# Altium schematic sheet Sheet1.SchDoc
size A0; SheetNumber: 1; SheetTotal: 1
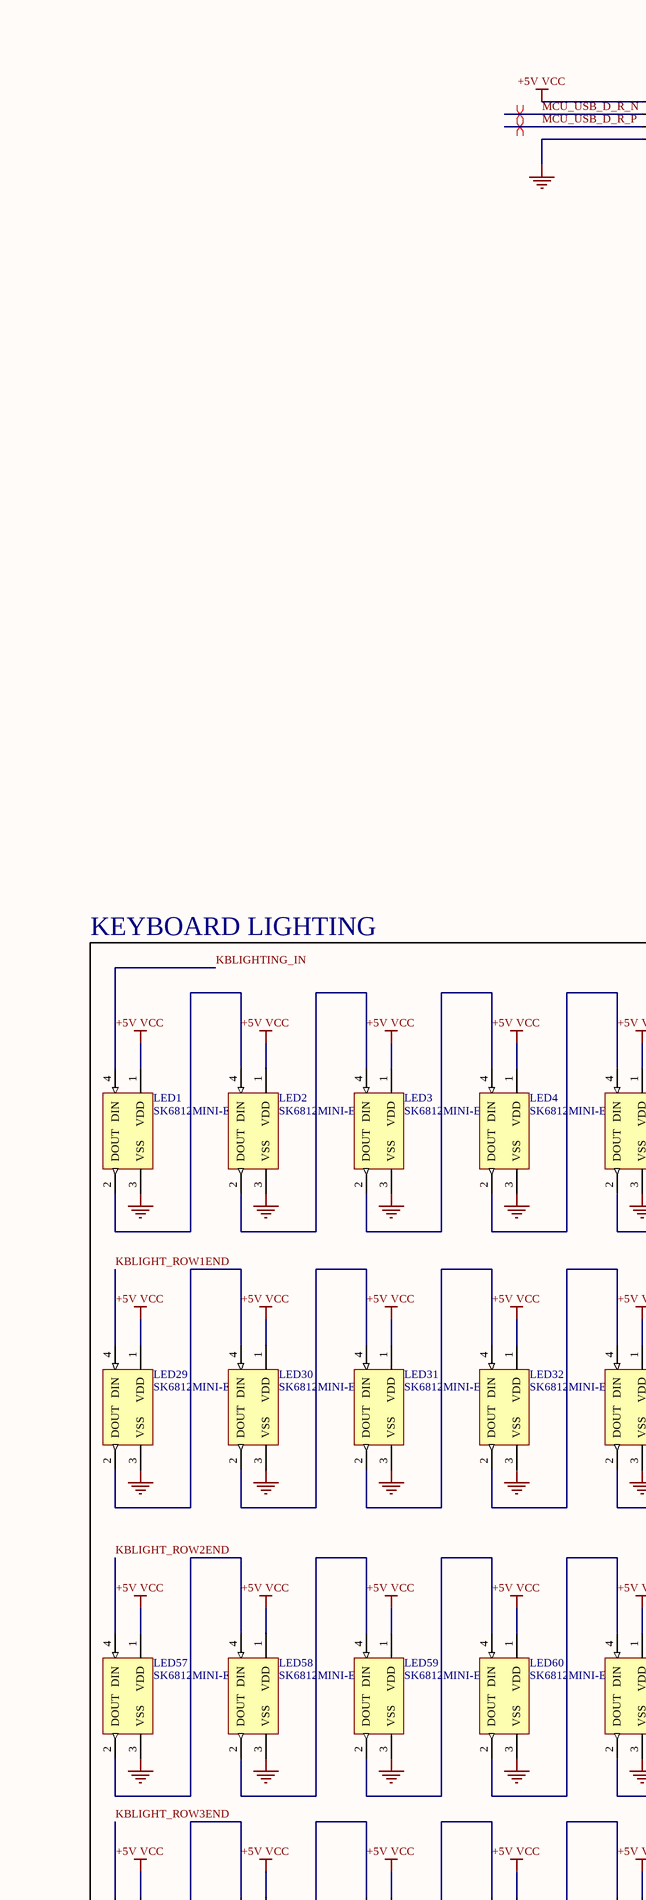
[diagram p0: Sheet1.SchDoc, top left]
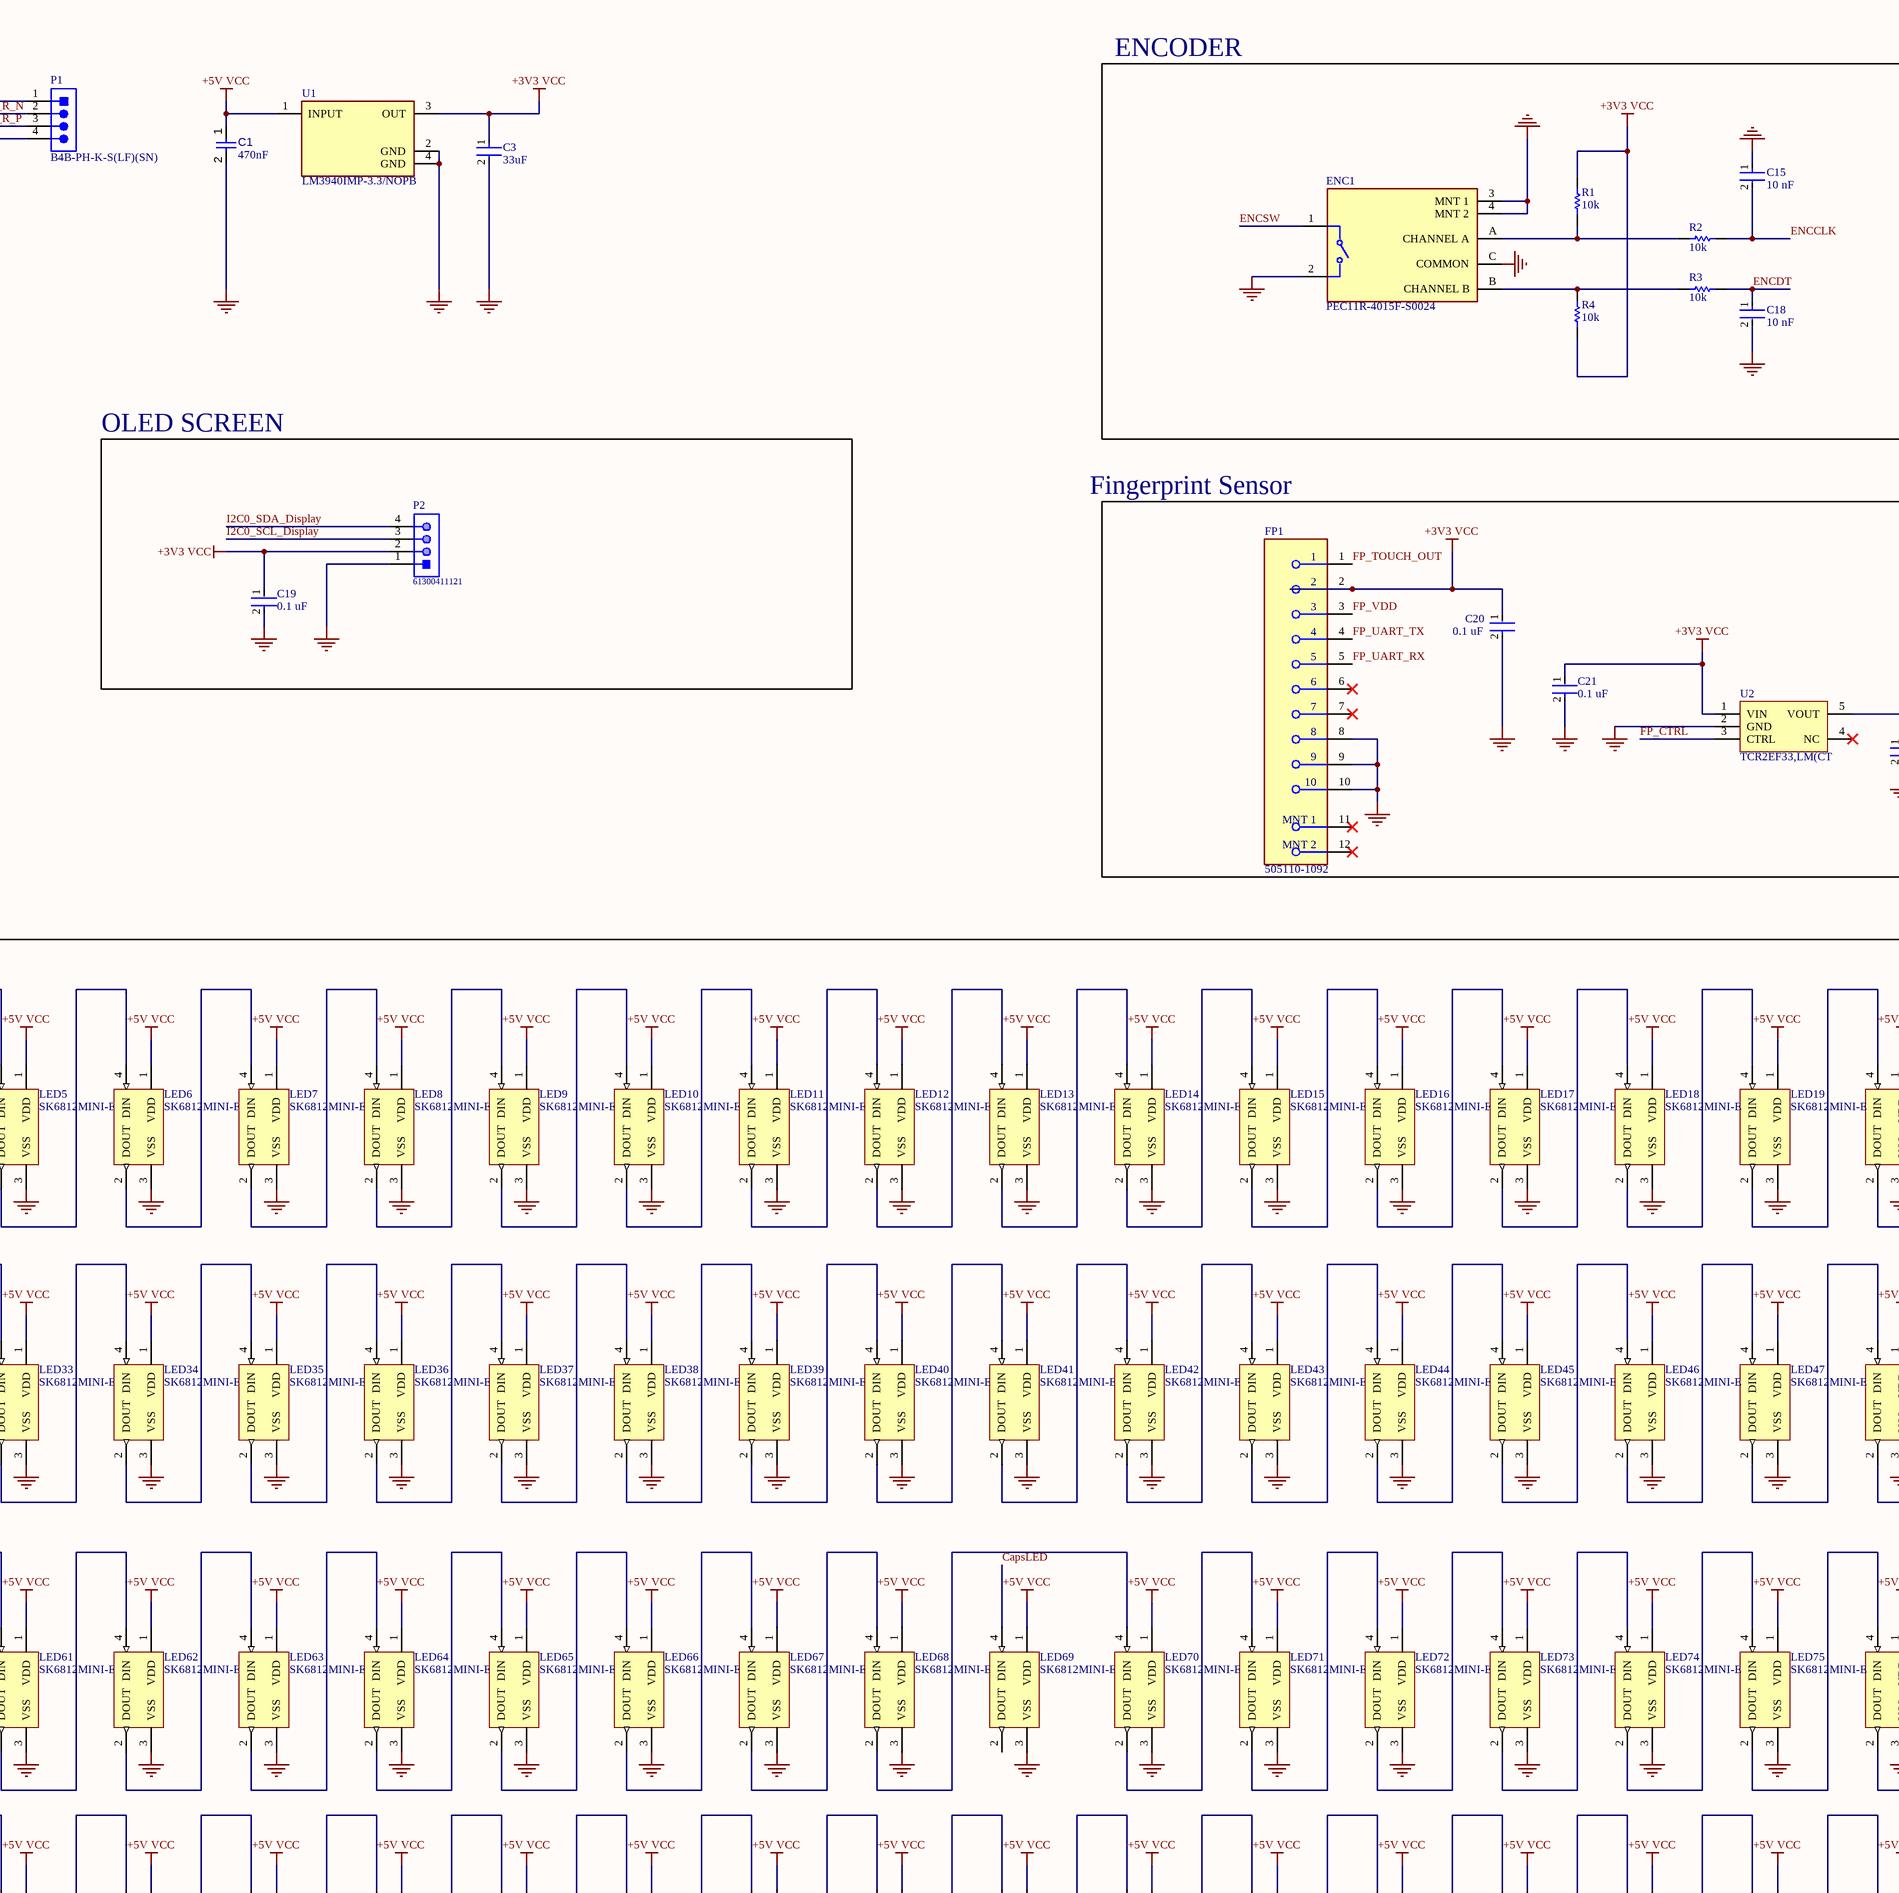
[diagram p1: Sheet1.SchDoc, top middle]
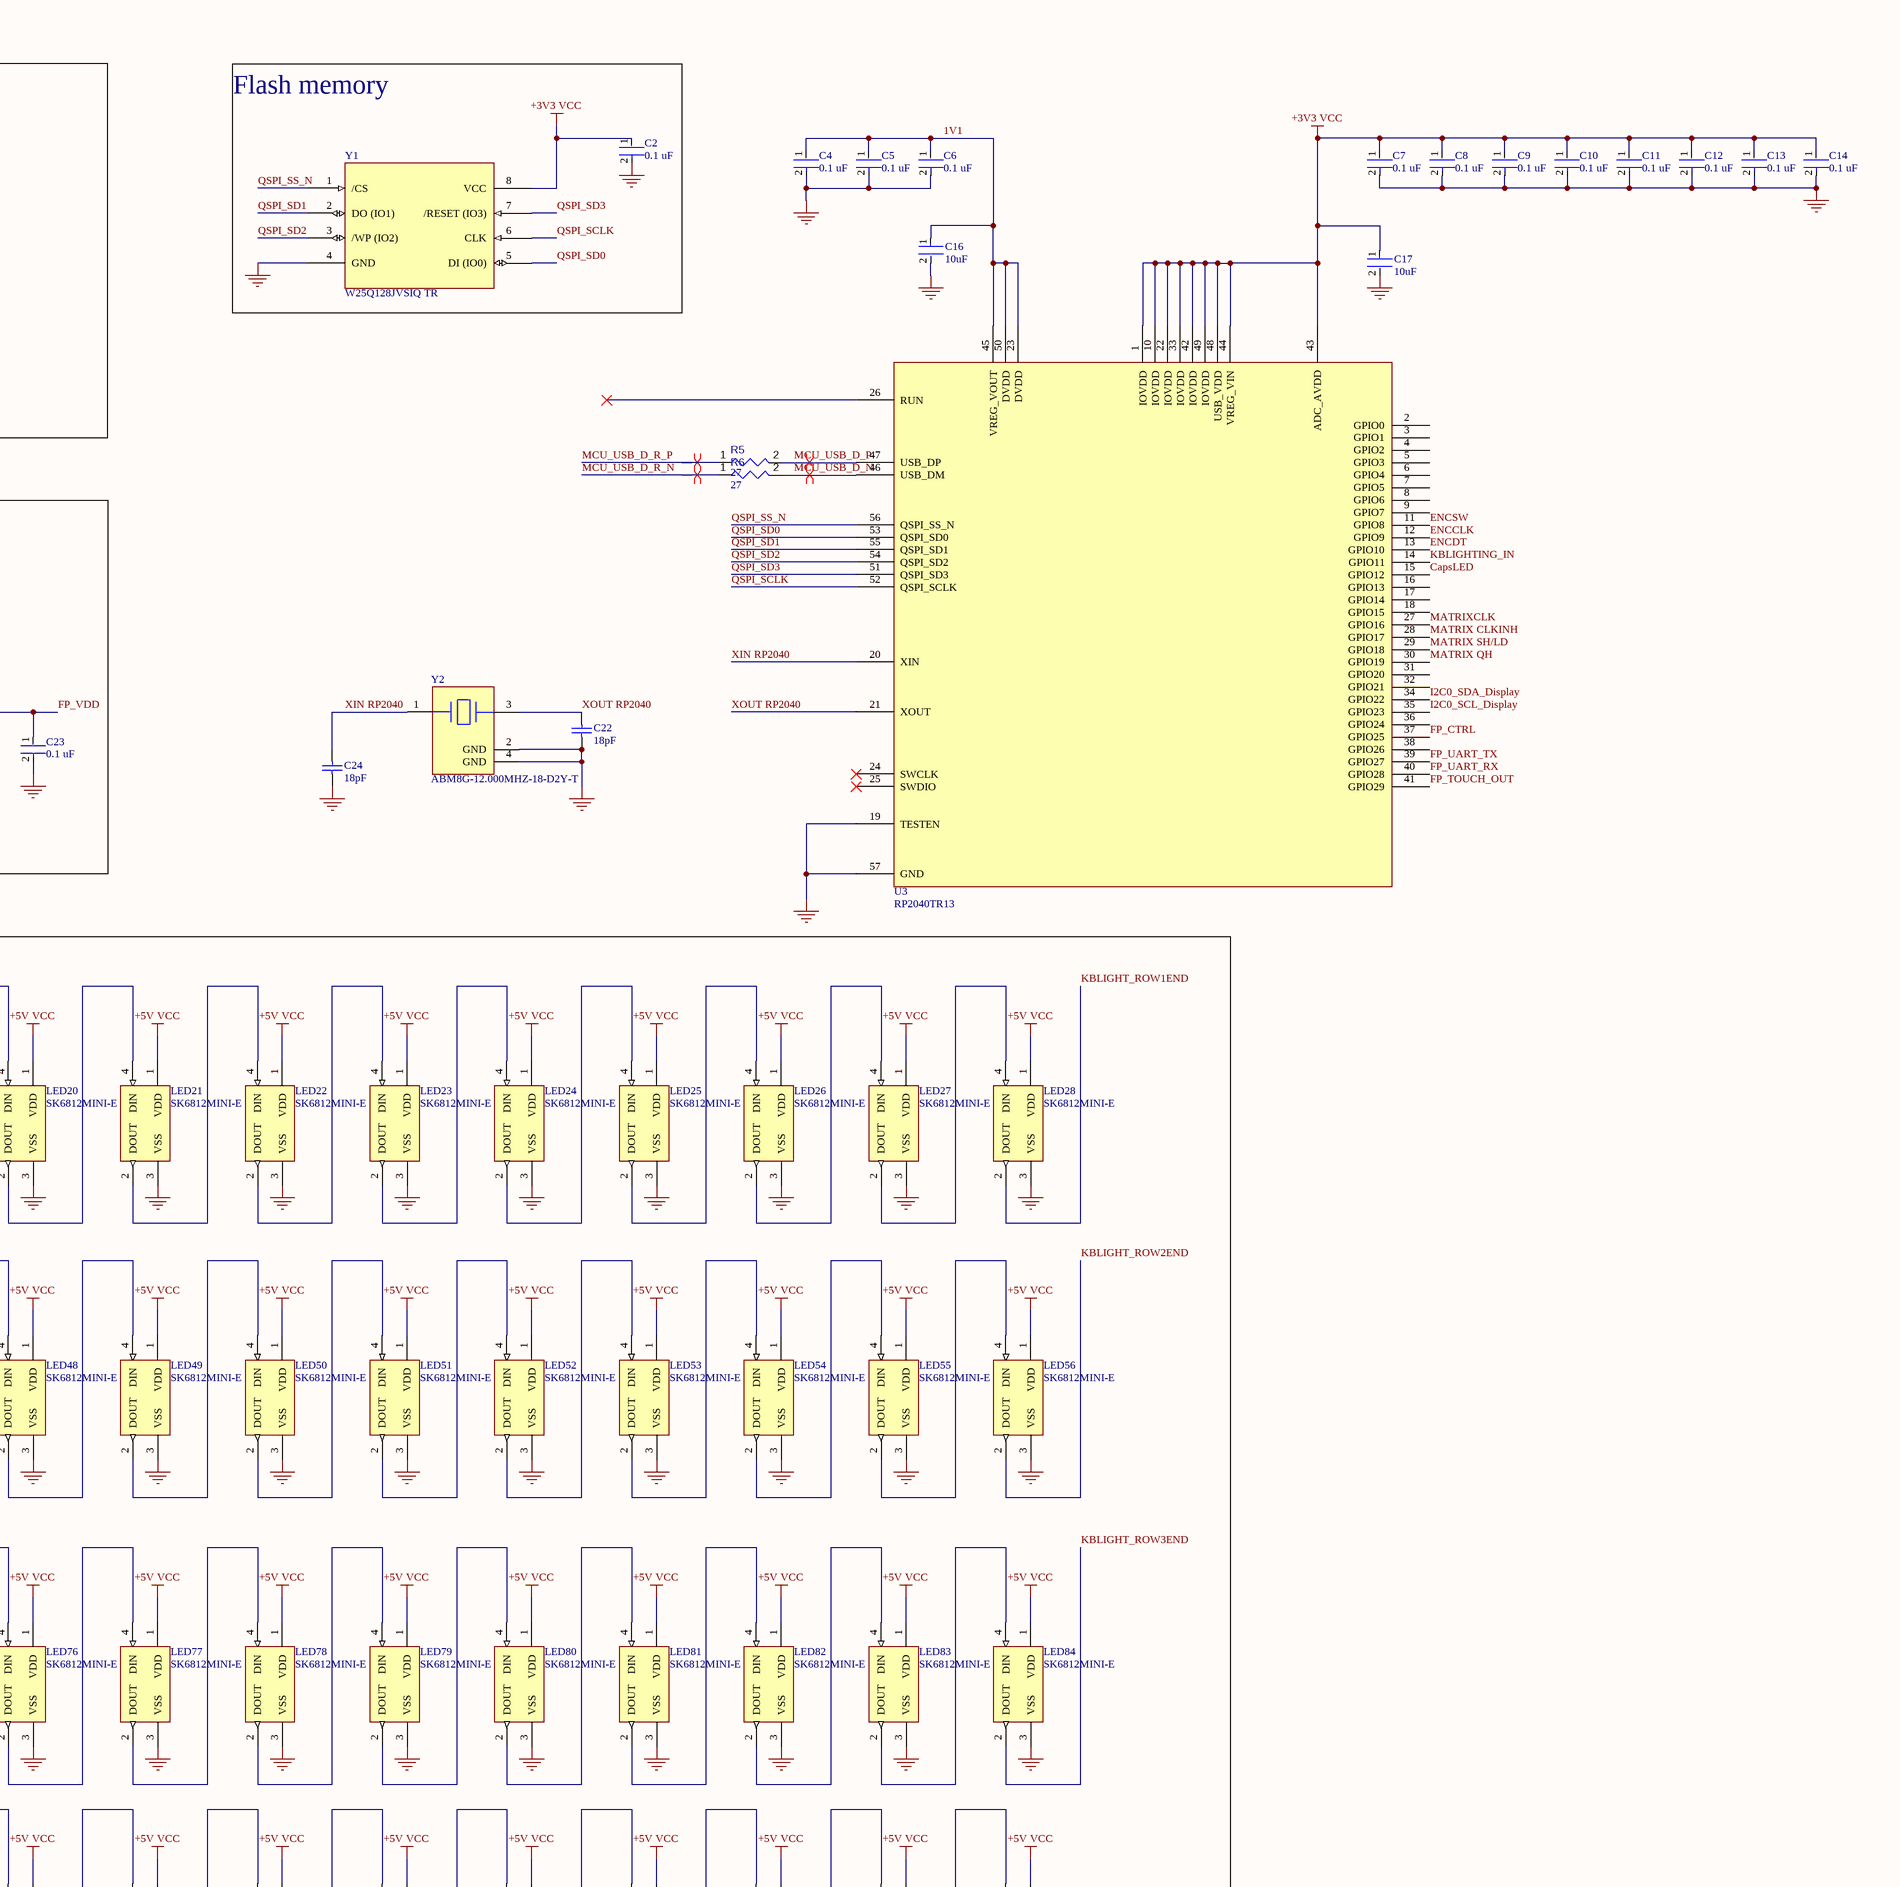
[diagram p2: Sheet1.SchDoc, top right]
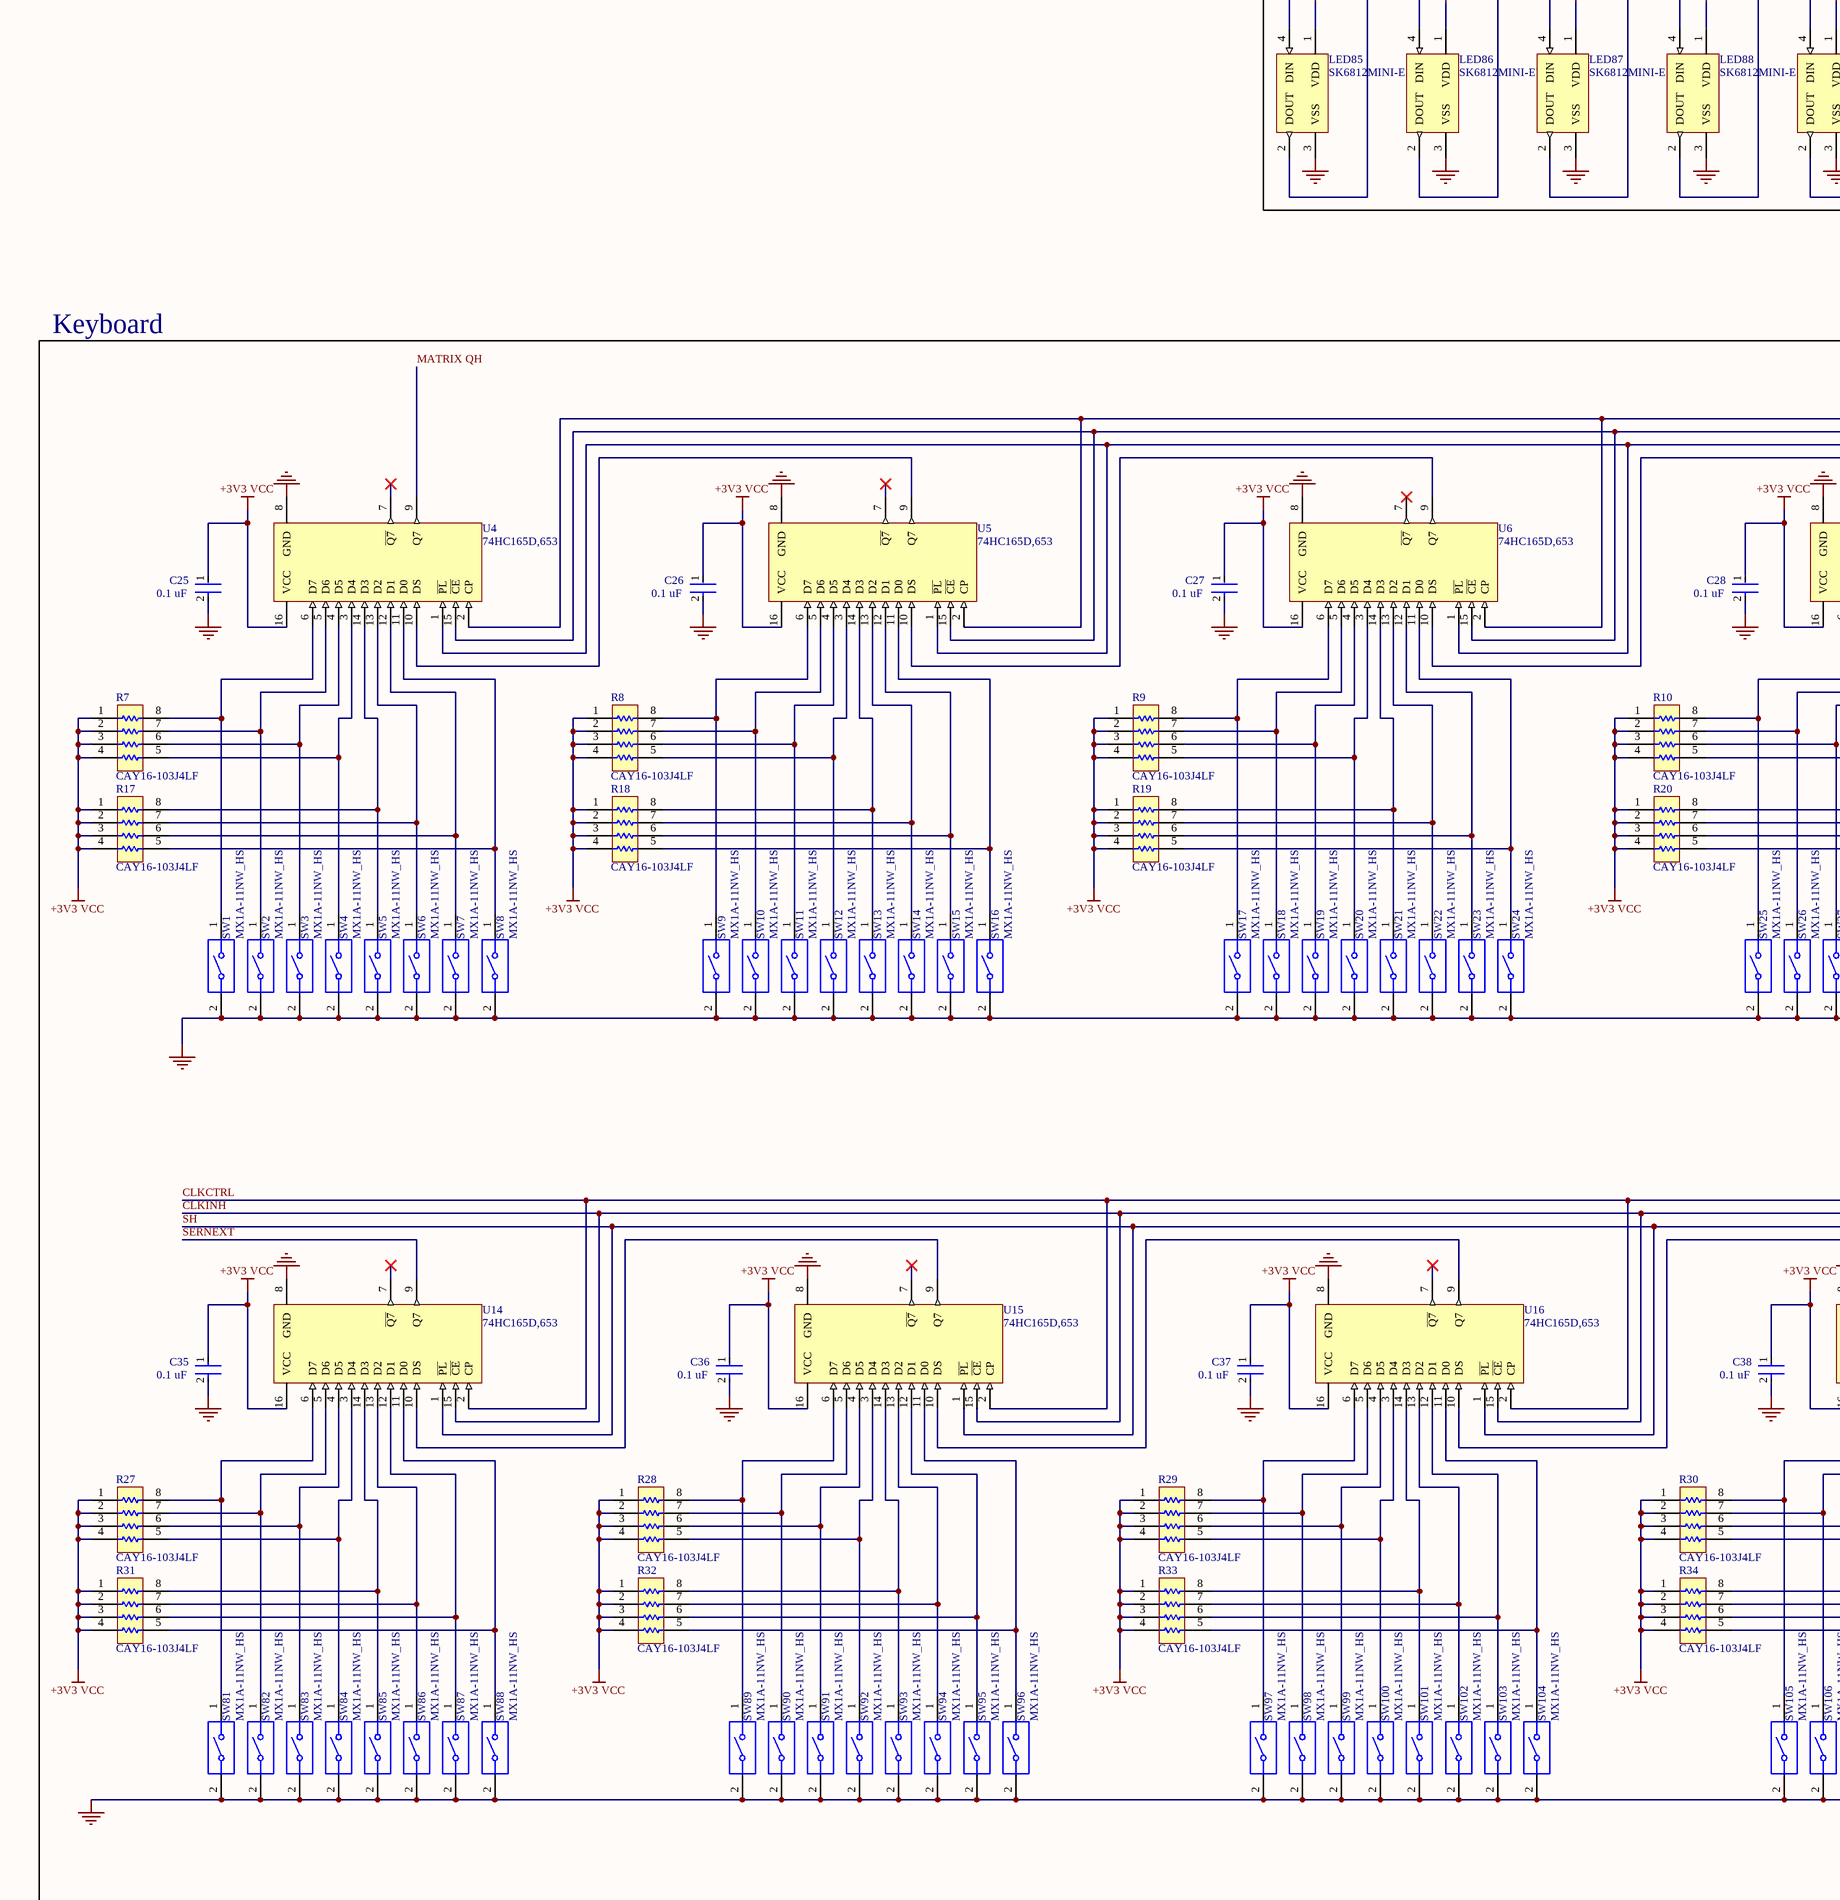
[diagram p3: Sheet1.SchDoc, bottom left]
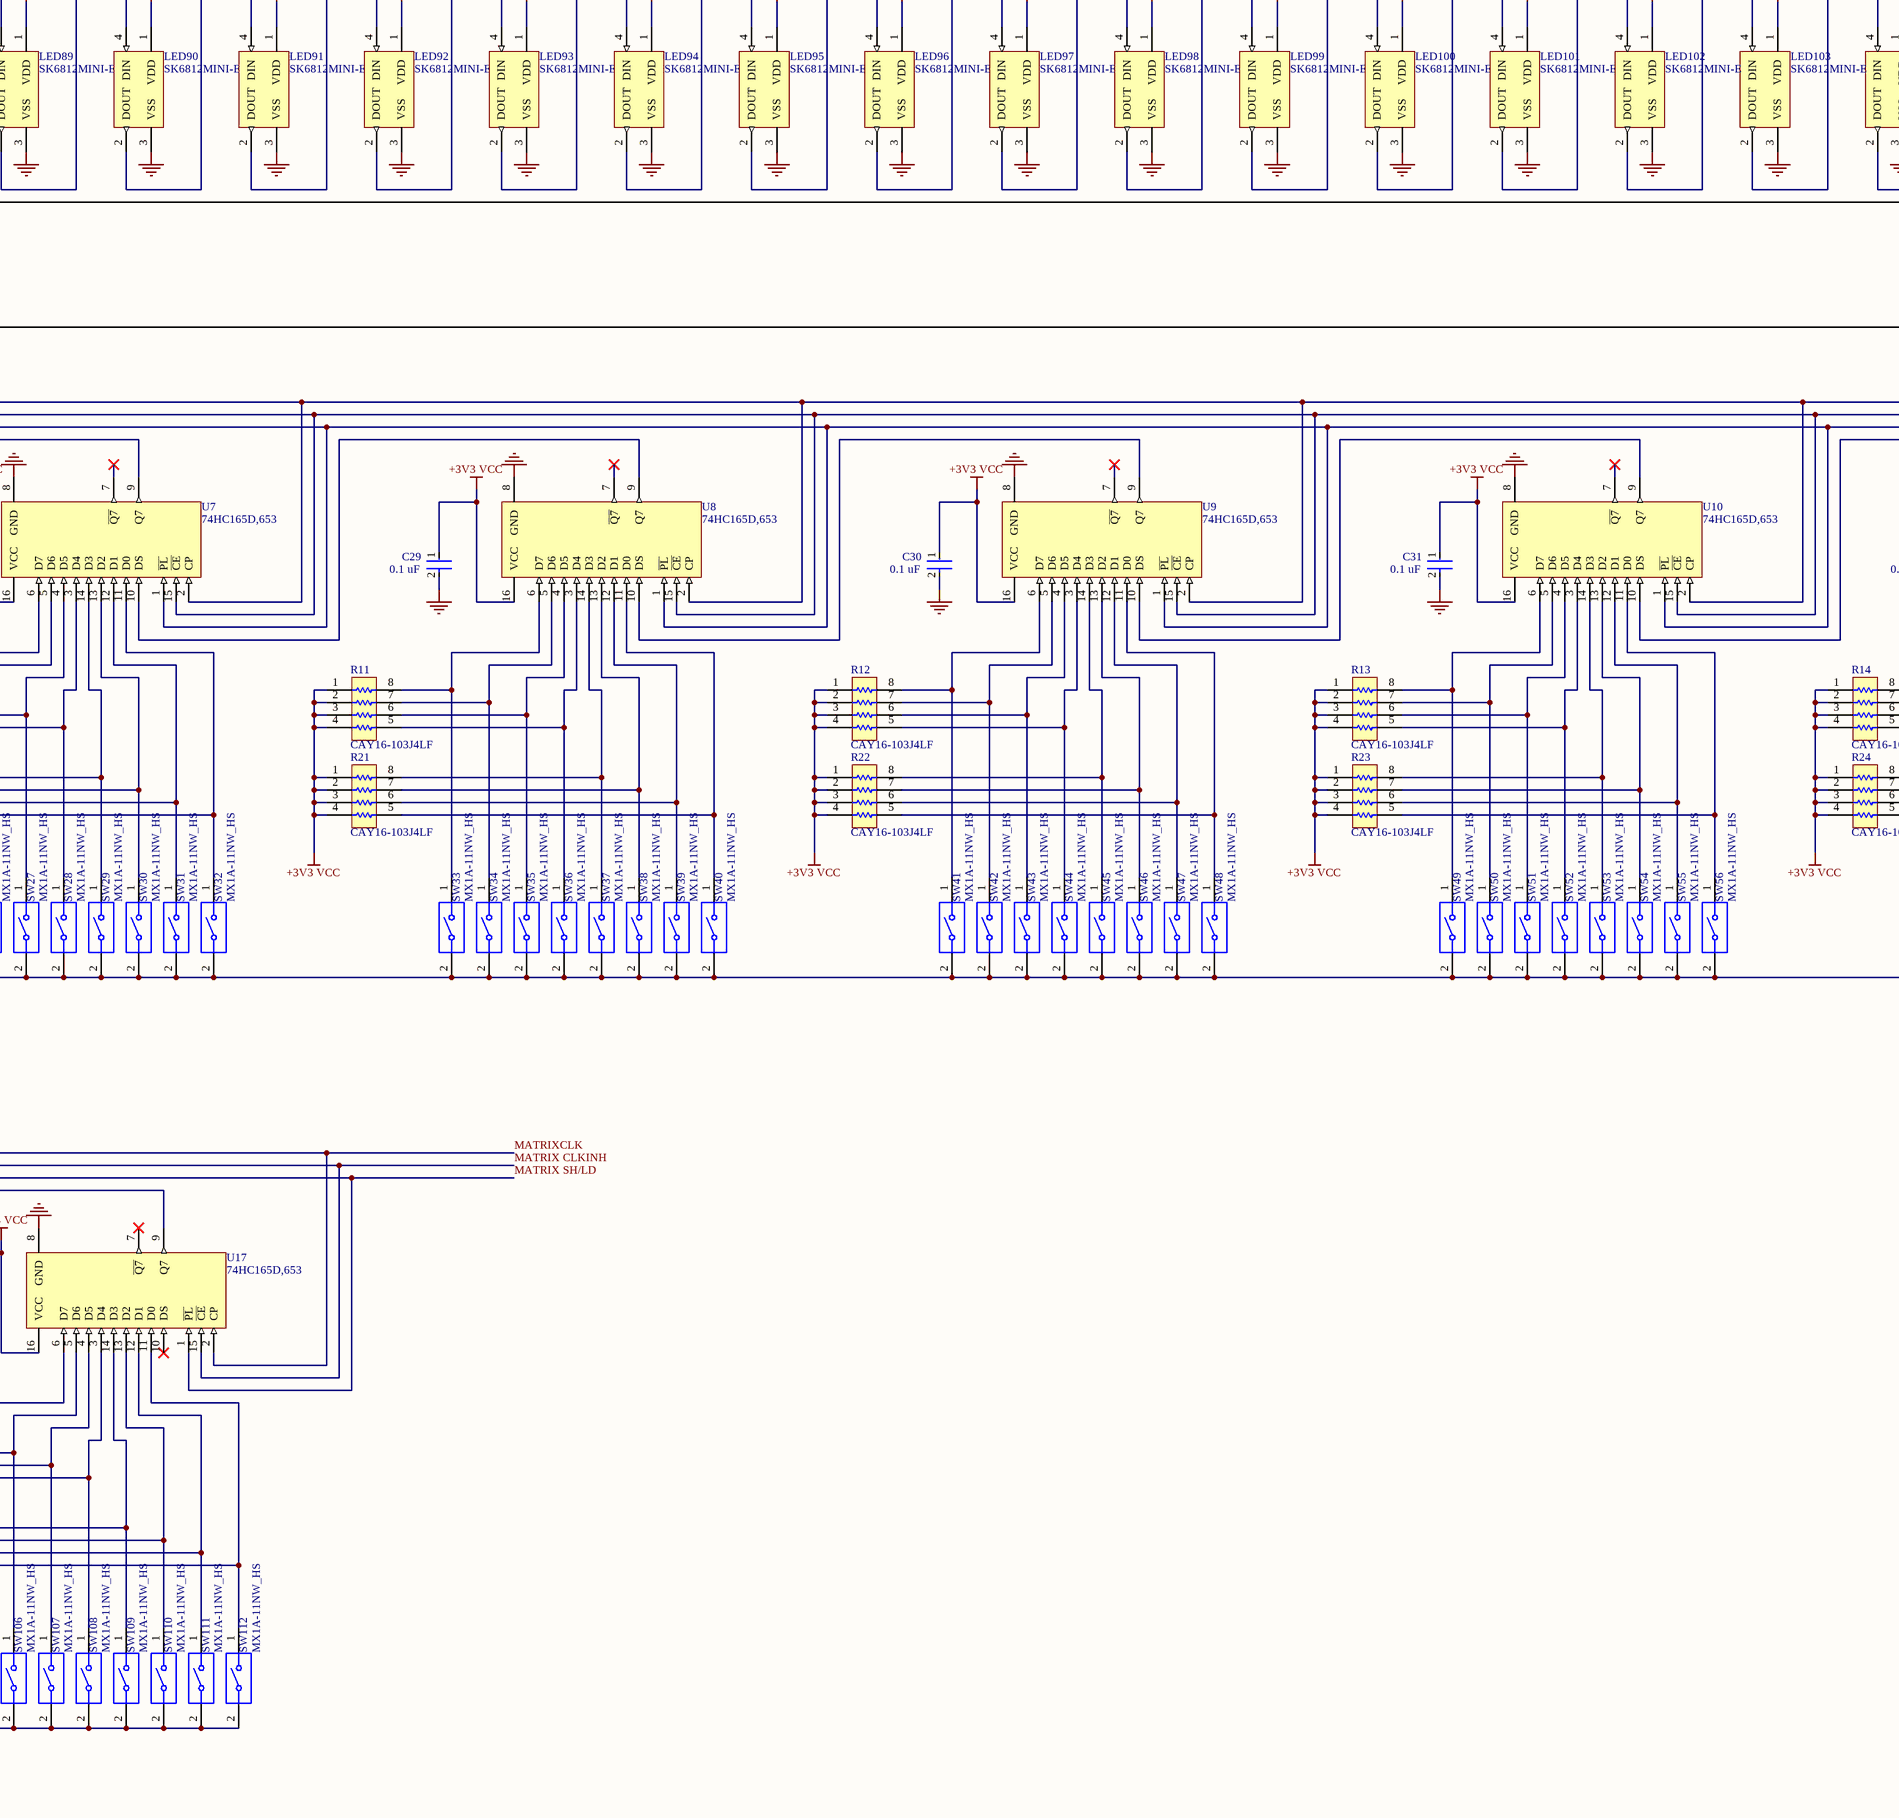
[diagram p4: Sheet1.SchDoc, bottom middle]
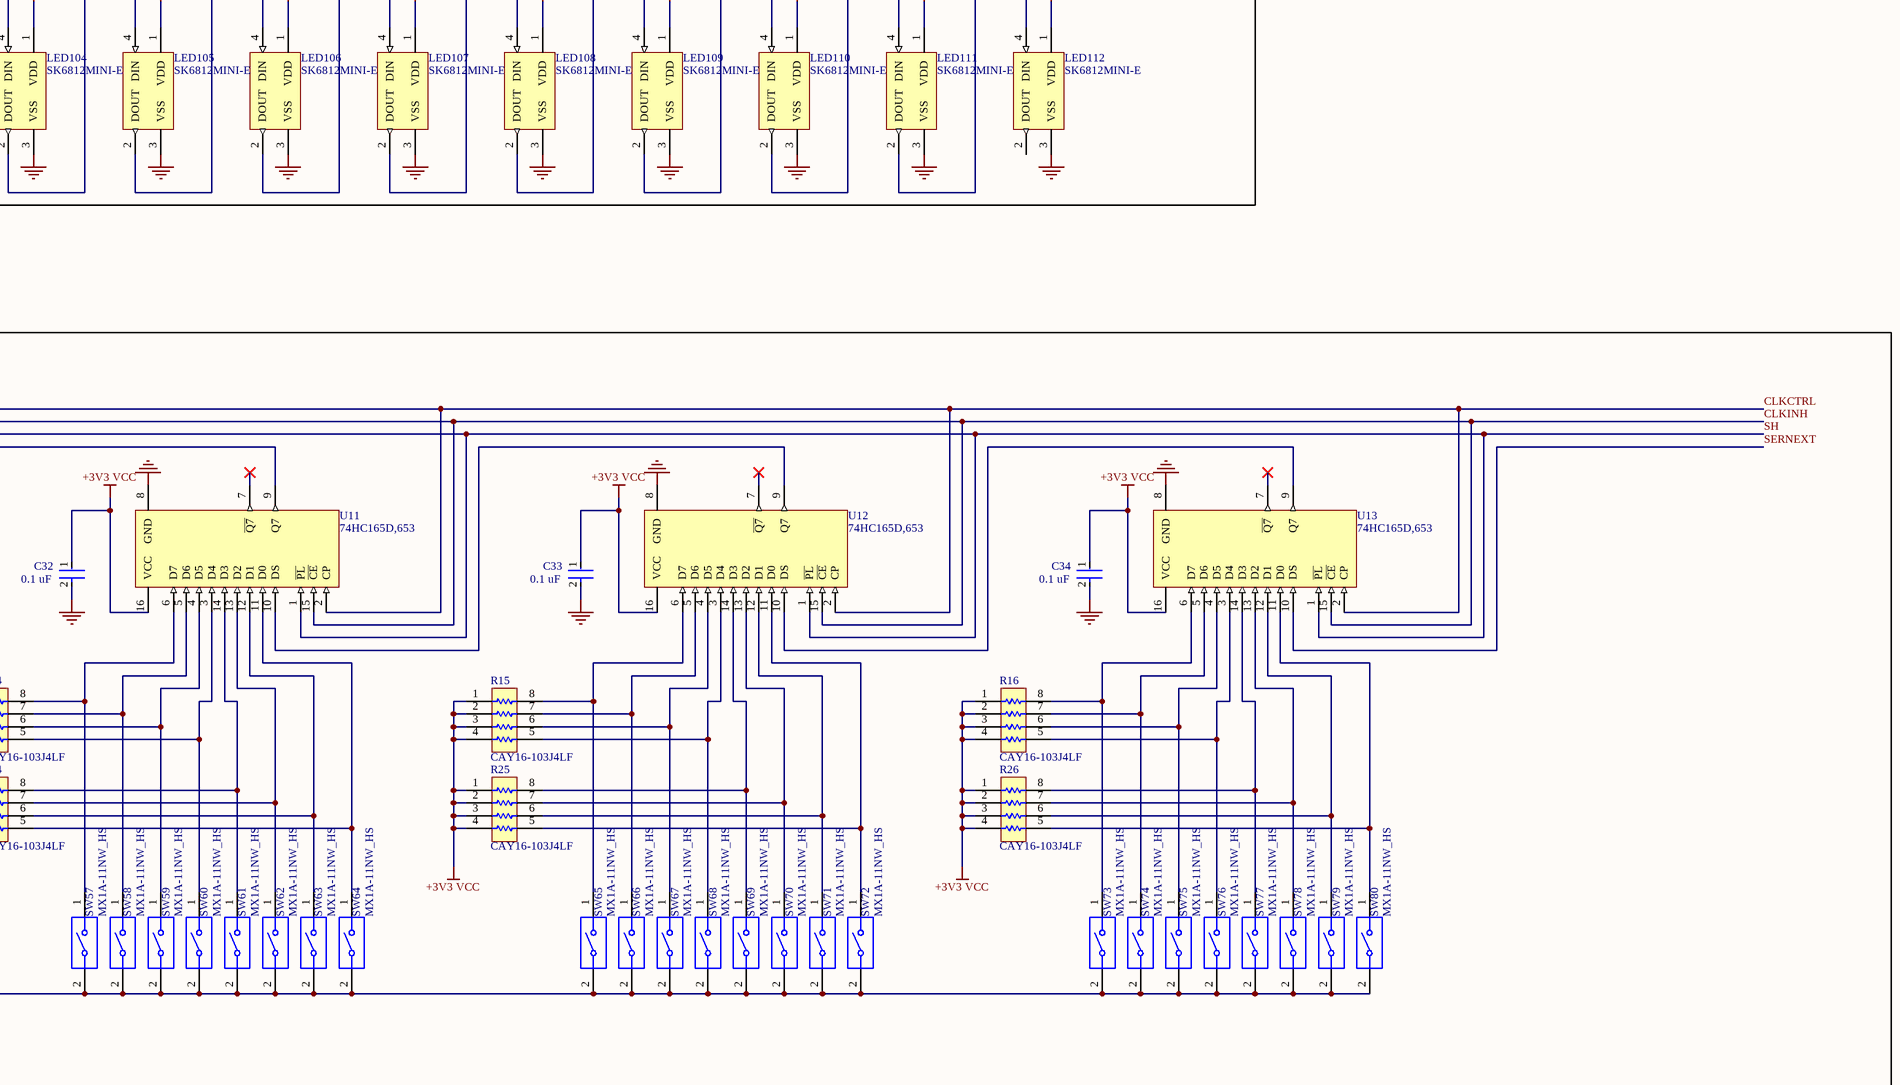
[diagram p5: Sheet1.SchDoc, bottom right]

## Parts
C1  value 470nF  [CAPC0603(1608)100_L]  (hidden comment: Capacitor 470nF +/-20% 25V 0603)
C2  0.1 uF  [FP-GRM15-MFG]
C3  33uF  [FP-C2012-125-0_2-IPC_A]
C4  0.1 uF  [FP-GRM15-MFG]
C5  0.1 uF  [FP-GRM15-MFG]
C6  0.1 uF  [FP-GRM15-MFG]
C7  0.1 uF  [FP-GRM15-MFG]
C8  0.1 uF  [FP-GRM15-MFG]
C9  0.1 uF  [FP-GRM15-MFG]
C10  0.1 uF  [FP-GRM15-MFG]
C11  0.1 uF  [FP-GRM15-MFG]
C12  0.1 uF  [FP-GRM15-MFG]
C13  0.1 uF  [FP-GRM15-MFG]
C14  0.1 uF  [FP-GRM15-MFG]
C15  10 nF  [FP-GRM033-0_03-IPC_A]
C16  10uF  [FP-GRM155-0_2-IPC_A]
C17  10uF  [FP-GRM155-0_2-IPC_A]
C18  10 nF  [FP-GRM033-0_03-IPC_A]
C19  0.1 uF  [FP-GRM15-MFG]
C20  0.1 uF  [FP-GRM15-MFG]
C21  0.1 uF  [FP-GRM15-MFG]
C22  18pF  [CAPC1608X90X35LL10T15]
C23  0.1 uF  [FP-GRM15-MFG]
C24  18pF  [CAPC1608X90X35LL10T15]
C25  0.1 uF  [FP-GRM15-MFG]
C26  0.1 uF  [FP-GRM15-MFG]
C27  0.1 uF  [FP-GRM15-MFG]
C28  0.1 uF  [FP-GRM15-MFG]
C29  0.1 uF  [FP-GRM15-MFG]
C30  0.1 uF  [FP-GRM15-MFG]
C31  0.1 uF  [FP-GRM15-MFG]
C32  0.1 uF  [FP-GRM15-MFG]
C33  0.1 uF  [FP-GRM15-MFG]
C34  0.1 uF  [FP-GRM15-MFG]
C35  0.1 uF  [FP-GRM15-MFG]
C36  0.1 uF  [FP-GRM15-MFG]
C37  0.1 uF  [FP-GRM15-MFG]
C38  0.1 uF  [FP-GRM15-MFG]
ENC1  PEC11R-4015F-S0024  [FP-PEC11R-4015F-S0024-MFG]
FP1  505110-1092  [FP-505110-1092-MFG]
LED1  SK6812MINI-E  [1655-Footprint-1]
LED2  SK6812MINI-E  [1655-Footprint-1]
LED3  SK6812MINI-E  [1655-Footprint-1]
LED4  SK6812MINI-E  [1655-Footprint-1]
LED5  SK6812MINI-E  [1655-Footprint-1]
LED6  SK6812MINI-E  [1655-Footprint-1]
LED7  SK6812MINI-E  [1655-Footprint-1]
LED8  SK6812MINI-E  [1655-Footprint-1]
LED9  SK6812MINI-E  [1655-Footprint-1]
LED10  SK6812MINI-E  [1655-Footprint-1]
LED11  SK6812MINI-E  [1655-Footprint-1]
LED12  SK6812MINI-E  [1655-Footprint-1]
LED13  SK6812MINI-E  [1655-Footprint-1]
LED14  SK6812MINI-E  [1655-Footprint-1]
LED15  SK6812MINI-E  [1655-Footprint-1]
LED16  SK6812MINI-E  [1655-Footprint-1]
LED17  SK6812MINI-E  [1655-Footprint-1]
LED18  SK6812MINI-E  [1655-Footprint-1]
LED19  SK6812MINI-E  [1655-Footprint-1]
LED20  SK6812MINI-E  [1655-Footprint-1]
LED21  SK6812MINI-E  [1655-Footprint-1]
LED22  SK6812MINI-E  [1655-Footprint-1]
LED23  SK6812MINI-E  [1655-Footprint-1]
LED24  SK6812MINI-E  [1655-Footprint-1]
LED25  SK6812MINI-E  [1655-Footprint-1]
LED26  SK6812MINI-E  [1655-Footprint-1]
LED27  SK6812MINI-E  [1655-Footprint-1]
LED28  SK6812MINI-E  [1655-Footprint-1]
LED29  SK6812MINI-E  [1655-Footprint-1]
LED30  SK6812MINI-E  [1655-Footprint-1]
LED31  SK6812MINI-E  [1655-Footprint-1]
LED32  SK6812MINI-E  [1655-Footprint-1]
LED33  SK6812MINI-E  [1655-Footprint-1]
LED34  SK6812MINI-E  [1655-Footprint-1]
LED35  SK6812MINI-E  [1655-Footprint-1]
LED36  SK6812MINI-E  [1655-Footprint-1]
LED37  SK6812MINI-E  [1655-Footprint-1]
LED38  SK6812MINI-E  [1655-Footprint-1]
LED39  SK6812MINI-E  [1655-Footprint-1]
LED40  SK6812MINI-E  [1655-Footprint-1]
LED41  SK6812MINI-E  [1655-Footprint-1]
LED42  SK6812MINI-E  [1655-Footprint-1]
LED43  SK6812MINI-E  [1655-Footprint-1]
LED44  SK6812MINI-E  [1655-Footprint-1]
LED45  SK6812MINI-E  [1655-Footprint-1]
LED46  SK6812MINI-E  [1655-Footprint-1]
LED47  SK6812MINI-E  [1655-Footprint-1]
LED48  SK6812MINI-E  [1655-Footprint-1]
LED49  SK6812MINI-E  [1655-Footprint-1]
LED50  SK6812MINI-E  [1655-Footprint-1]
LED51  SK6812MINI-E  [1655-Footprint-1]
LED52  SK6812MINI-E  [1655-Footprint-1]
LED53  SK6812MINI-E  [1655-Footprint-1]
LED54  SK6812MINI-E  [1655-Footprint-1]
LED55  SK6812MINI-E  [1655-Footprint-1]
LED56  SK6812MINI-E  [1655-Footprint-1]
LED57  SK6812MINI-E  [1655-Footprint-1]
LED58  SK6812MINI-E  [1655-Footprint-1]
LED59  SK6812MINI-E  [1655-Footprint-1]
LED60  SK6812MINI-E  [1655-Footprint-1]
LED61  SK6812MINI-E  [1655-Footprint-1]
LED62  SK6812MINI-E  [1655-Footprint-1]
LED63  SK6812MINI-E  [1655-Footprint-1]
LED64  SK6812MINI-E  [1655-Footprint-1]
LED65  SK6812MINI-E  [1655-Footprint-1]
LED66  SK6812MINI-E  [1655-Footprint-1]
LED67  SK6812MINI-E  [1655-Footprint-1]
LED68  SK6812MINI-E  [1655-Footprint-1]
LED69  SK6812MINI-E  [1655-Footprint-1]
LED70  SK6812MINI-E  [1655-Footprint-1]
LED71  SK6812MINI-E  [1655-Footprint-1]
LED72  SK6812MINI-E  [1655-Footprint-1]
LED73  SK6812MINI-E  [1655-Footprint-1]
LED74  SK6812MINI-E  [1655-Footprint-1]
LED75  SK6812MINI-E  [1655-Footprint-1]
LED76  SK6812MINI-E  [1655-Footprint-1]
LED77  SK6812MINI-E  [1655-Footprint-1]
LED78  SK6812MINI-E  [1655-Footprint-1]
LED79  SK6812MINI-E  [1655-Footprint-1]
LED80  SK6812MINI-E  [1655-Footprint-1]
LED81  SK6812MINI-E  [1655-Footprint-1]
LED82  SK6812MINI-E  [1655-Footprint-1]
LED83  SK6812MINI-E  [1655-Footprint-1]
LED84  SK6812MINI-E  [1655-Footprint-1]
LED85  SK6812MINI-E  [1655-Footprint-1]
LED86  SK6812MINI-E  [1655-Footprint-1]
LED87  SK6812MINI-E  [1655-Footprint-1]
LED88  SK6812MINI-E  [1655-Footprint-1]
LED89  SK6812MINI-E  [1655-Footprint-1]
LED90  SK6812MINI-E  [1655-Footprint-1]
LED91  SK6812MINI-E  [1655-Footprint-1]
LED92  SK6812MINI-E  [1655-Footprint-1]
LED93  SK6812MINI-E  [1655-Footprint-1]
LED94  SK6812MINI-E  [1655-Footprint-1]
LED95  SK6812MINI-E  [1655-Footprint-1]
LED96  SK6812MINI-E  [1655-Footprint-1]
LED97  SK6812MINI-E  [1655-Footprint-1]
LED98  SK6812MINI-E  [1655-Footprint-1]
LED99  SK6812MINI-E  [1655-Footprint-1]
LED100  SK6812MINI-E  [1655-Footprint-1]
LED101  SK6812MINI-E  [1655-Footprint-1]
LED102  SK6812MINI-E  [1655-Footprint-1]
LED103  SK6812MINI-E  [1655-Footprint-1]
LED104  SK6812MINI-E  [1655-Footprint-1]
LED105  SK6812MINI-E  [1655-Footprint-1]
LED106  SK6812MINI-E  [1655-Footprint-1]
LED107  SK6812MINI-E  [1655-Footprint-1]
LED108  SK6812MINI-E  [1655-Footprint-1]
LED109  SK6812MINI-E  [1655-Footprint-1]
LED110  SK6812MINI-E  [1655-Footprint-1]
LED111  SK6812MINI-E  [1655-Footprint-1]
LED112  SK6812MINI-E  [1655-Footprint-1]
P1  B4B-PH-K-S(LF)(SN)  [JST-B4B-PH-K-S_V]
P2  61300411121  [61300411121]
R1  10k  [RESC1005X40X25ML05T05]
R2  10k  [RESC1005X40X25ML05T05]
R3  10k  [RESC1005X40X25ML05T05]
R4  10k  [RESC1005X40X25ML05T05]
R5  value 27  [RESC1005X40X25NL05T10]  (hidden comment: RC0402FR-0727RL)
R6  value 27  [RESC1005X40X25NL05T10]  (hidden comment: RC0402FR-0727RL)
R7  CAY16-103J4LF  [BOUR-CAY16-J4_V]
R8  CAY16-103J4LF  [BOUR-CAY16-J4_V]
R9  CAY16-103J4LF  [BOUR-CAY16-J4_V]
R10  CAY16-103J4LF  [BOUR-CAY16-J4_V]
R11  CAY16-103J4LF  [BOUR-CAY16-J4_V]
R12  CAY16-103J4LF  [BOUR-CAY16-J4_V]
R13  CAY16-103J4LF  [BOUR-CAY16-J4_V]
R14  CAY16-103J4LF  [BOUR-CAY16-J4_V]
R15  CAY16-103J4LF  [BOUR-CAY16-J4_V]
R16  CAY16-103J4LF  [BOUR-CAY16-J4_V]
R17  CAY16-103J4LF  [BOUR-CAY16-J4_V]
R18  CAY16-103J4LF  [BOUR-CAY16-J4_V]
R19  CAY16-103J4LF  [BOUR-CAY16-J4_V]
R20  CAY16-103J4LF  [BOUR-CAY16-J4_V]
R21  CAY16-103J4LF  [BOUR-CAY16-J4_V]
R22  CAY16-103J4LF  [BOUR-CAY16-J4_V]
R23  CAY16-103J4LF  [BOUR-CAY16-J4_V]
R24  CAY16-103J4LF  [BOUR-CAY16-J4_V]
R25  CAY16-103J4LF  [BOUR-CAY16-J4_V]
R26  CAY16-103J4LF  [BOUR-CAY16-J4_V]
R27  CAY16-103J4LF  [BOUR-CAY16-J4_V]
R28  CAY16-103J4LF  [BOUR-CAY16-J4_V]
R29  CAY16-103J4LF  [BOUR-CAY16-J4_V]
R30  CAY16-103J4LF  [BOUR-CAY16-J4_V]
R31  CAY16-103J4LF  [BOUR-CAY16-J4_V]
R32  CAY16-103J4LF  [BOUR-CAY16-J4_V]
R33  CAY16-103J4LF  [BOUR-CAY16-J4_V]
R34  CAY16-103J4LF  [BOUR-CAY16-J4_V]
SW1  MX1A-11NW_HS  [MX1A-11NW-Footprint-1]
SW2  MX1A-11NW_HS  [MX1A-11NW-Footprint-1]
SW3  MX1A-11NW_HS  [MX1A-11NW-Footprint-1]
SW4  MX1A-11NW_HS  [MX1A-11NW-Footprint-1]
SW5  MX1A-11NW_HS  [MX1A-11NW-Footprint-1]
SW6  MX1A-11NW_HS  [MX1A-11NW-Footprint-1]
SW7  MX1A-11NW_HS  [MX1A-11NW-Footprint-1]
SW8  MX1A-11NW_HS  [MX1A-11NW-Footprint-1]
SW9  MX1A-11NW_HS  [MX1A-11NW-Footprint-1]
SW10  MX1A-11NW_HS  [MX1A-11NW-Footprint-1]
SW11  MX1A-11NW_HS  [MX1A-11NW-Footprint-1]
SW12  MX1A-11NW_HS  [MX1A-11NW-Footprint-1]
SW13  MX1A-11NW_HS  [MX1A-11NW-Footprint-1]
SW14  MX1A-11NW_HS  [MX1A-11NW-Footprint-1]
SW15  MX1A-11NW_HS  [MX1A-11NW-Footprint-1]
SW16  MX1A-11NW_HS  [MX1A-11NW-Footprint-1]
SW17  MX1A-11NW_HS  [MX1A-11NW-Footprint-1]
SW18  MX1A-11NW_HS  [MX1A-11NW-Footprint-1]
SW19  MX1A-11NW_HS  [MX1A-11NW-Footprint-1]
SW20  MX1A-11NW_HS  [MX1A-11NW-Footprint-1]
SW21  MX1A-11NW_HS  [MX1A-11NW-Footprint-1]
SW22  MX1A-11NW_HS  [MX1A-11NW-Footprint-1]
SW23  MX1A-11NW_HS  [MX1A-11NW-Footprint-1]
SW24  MX1A-11NW_HS  [MX1A-11NW-Footprint-1]
SW25  MX1A-11NW_HS  [MX1A-11NW-Footprint-1]
SW26  MX1A-11NW_HS  [MX1A-11NW-Footprint-1]
SW27  MX1A-11NW_HS  [MX1A-11NW-Footprint-1]
SW28  MX1A-11NW_HS  [MX1A-11NW-Footprint-1]
SW29  MX1A-11NW_HS  [MX1A-11NW-Footprint-1]
SW30  MX1A-11NW_HS  [MX1A-11NW-Footprint-1]
SW31  MX1A-11NW_HS  [MX1A-11NW-Footprint-1]
SW32  MX1A-11NW_HS  [MX1A-11NW-Footprint-1]
SW33  MX1A-11NW_HS  [MX1A-11NW-Footprint-1]
SW34  MX1A-11NW_HS  [MX1A-11NW-Footprint-1]
SW35  MX1A-11NW_HS  [MX1A-11NW-Footprint-1]
SW36  MX1A-11NW_HS  [MX1A-11NW-Footprint-1]
SW37  MX1A-11NW_HS  [MX1A-11NW-Footprint-1]
SW38  MX1A-11NW_HS  [MX1A-11NW-Footprint-1]
SW39  MX1A-11NW_HS  [MX1A-11NW-Footprint-1]
SW40  MX1A-11NW_HS  [MX1A-11NW-Footprint-1]
SW41  MX1A-11NW_HS  [MX1A-11NW-Footprint-1]
SW42  MX1A-11NW_HS  [MX1A-11NW-Footprint-1]
SW43  MX1A-11NW_HS  [MX1A-11NW-Footprint-1]
SW44  MX1A-11NW_HS  [MX1A-11NW-Footprint-1]
SW45  MX1A-11NW_HS  [MX1A-11NW-Footprint-1]
SW46  MX1A-11NW_HS  [MX1A-11NW-Footprint-1]
SW47  MX1A-11NW_HS  [MX1A-11NW-Footprint-1]
SW48  MX1A-11NW_HS  [MX1A-11NW-Footprint-1]
SW49  MX1A-11NW_HS  [MX1A-11NW-Footprint-1]
SW50  MX1A-11NW_HS  [MX1A-11NW-Footprint-1]
SW51  MX1A-11NW_HS  [MX1A-11NW-Footprint-1]
SW52  MX1A-11NW_HS  [MX1A-11NW-Footprint-1]
SW53  MX1A-11NW_HS  [MX1A-11NW-Footprint-1]
SW54  MX1A-11NW_HS  [MX1A-11NW-Footprint-1]
SW55  MX1A-11NW_HS  [MX1A-11NW-Footprint-1]
SW56  MX1A-11NW_HS  [MX1A-11NW-Footprint-1]
SW57  MX1A-11NW_HS  [MX1A-11NW-Footprint-1]
SW58  MX1A-11NW_HS  [MX1A-11NW-Footprint-1]
SW59  MX1A-11NW_HS  [MX1A-11NW-Footprint-1]
SW60  MX1A-11NW_HS  [MX1A-11NW-Footprint-1]
SW61  MX1A-11NW_HS  [MX1A-11NW-Footprint-1]
SW62  MX1A-11NW_HS  [MX1A-11NW-Footprint-1]
SW63  MX1A-11NW_HS  [MX1A-11NW-Footprint-1]
SW64  MX1A-11NW_HS  [MX1A-11NW-Footprint-1]
SW65  MX1A-11NW_HS  [MX1A-11NW-Footprint-1]
SW66  MX1A-11NW_HS  [MX1A-11NW-Footprint-1]
SW67  MX1A-11NW_HS  [MX1A-11NW-Footprint-1]
SW68  MX1A-11NW_HS  [MX1A-11NW-Footprint-1]
SW69  MX1A-11NW_HS  [MX1A-11NW-Footprint-1]
SW70  MX1A-11NW_HS  [MX1A-11NW-Footprint-1]
SW71  MX1A-11NW_HS  [MX1A-11NW-Footprint-1]
SW72  MX1A-11NW_HS  [MX1A-11NW-Footprint-1]
SW73  MX1A-11NW_HS  [MX1A-11NW-Footprint-1]
SW74  MX1A-11NW_HS  [MX1A-11NW-Footprint-1]
SW75  MX1A-11NW_HS  [MX1A-11NW-Footprint-1]
SW76  MX1A-11NW_HS  [MX1A-11NW-Footprint-1]
SW77  MX1A-11NW_HS  [MX1A-11NW-Footprint-1]
SW78  MX1A-11NW_HS  [MX1A-11NW-Footprint-1]
SW79  MX1A-11NW_HS  [MX1A-11NW-Footprint-1]
SW80  MX1A-11NW_HS  [MX1A-11NW-Footprint-1]
SW81  MX1A-11NW_HS  [MX1A-11NW-Footprint-1]
SW82  MX1A-11NW_HS  [MX1A-11NW-Footprint-1]
SW83  MX1A-11NW_HS  [MX1A-11NW-Footprint-1]
SW84  MX1A-11NW_HS  [MX1A-11NW-Footprint-1]
SW85  MX1A-11NW_HS  [MX1A-11NW-Footprint-1]
SW86  MX1A-11NW_HS  [MX1A-11NW-Footprint-1]
SW87  MX1A-11NW_HS  [MX1A-11NW-Footprint-1]
SW88  MX1A-11NW_HS  [MX1A-11NW-Footprint-1]
SW89  MX1A-11NW_HS  [MX1A-11NW-Footprint-1]
SW90  MX1A-11NW_HS  [MX1A-11NW-Footprint-1]
SW91  MX1A-11NW_HS  [MX1A-11NW-Footprint-1]
SW92  MX1A-11NW_HS  [MX1A-11NW-Footprint-1]
SW93  MX1A-11NW_HS  [MX1A-11NW-Footprint-1]
SW94  MX1A-11NW_HS  [MX1A-11NW-Footprint-1]
SW95  MX1A-11NW_HS  [MX1A-11NW-Footprint-1]
SW96  MX1A-11NW_HS  [MX1A-11NW-Footprint-1]
SW97  MX1A-11NW_HS  [MX1A-11NW-Footprint-1]
SW98  MX1A-11NW_HS  [MX1A-11NW-Footprint-1]
SW99  MX1A-11NW_HS  [MX1A-11NW-Footprint-1]
SW100  MX1A-11NW_HS  [MX1A-11NW-Footprint-1]
SW101  MX1A-11NW_HS  [MX1A-11NW-Footprint-1]
SW102  MX1A-11NW_HS  [MX1A-11NW-Footprint-1]
SW103  MX1A-11NW_HS  [MX1A-11NW-Footprint-1]
SW104  MX1A-11NW_HS  [MX1A-11NW-Footprint-1]
SW105  MX1A-11NW_HS  [MX1A-11NW-Footprint-1]
SW106  MX1A-11NW_HS  [MX1A-11NW-Footprint-1]
SW107  MX1A-11NW_HS  [MX1A-11NW-Footprint-1]
SW108  MX1A-11NW_HS  [MX1A-11NW-Footprint-1]
SW109  MX1A-11NW_HS  [MX1A-11NW-Footprint-1]
SW110  MX1A-11NW_HS  [MX1A-11NW-Footprint-1]
SW111  MX1A-11NW_HS  [MX1A-11NW-Footprint-1]
SW112  MX1A-11NW_HS  [MX1A-11NW-Footprint-1]
U1  LM3940IMP-3.3/NOPB  [FP-DCY0004A-MFG]
U2  TCR2EF33,LM(CT  [SOT95P275X140-5N]
U3  RP2040TR13  [QFN40P700X700X90_HS-57N]
U4  74HC165D,653  [FP-SOT109-1-IPC_B]
U5  74HC165D,653  [FP-SOT109-1-IPC_B]
U6  74HC165D,653  [FP-SOT109-1-IPC_B]
U7  74HC165D,653  [FP-SOT109-1-IPC_B]
U8  74HC165D,653  [FP-SOT109-1-IPC_B]
U9  74HC165D,653  [FP-SOT109-1-IPC_B]
U10  74HC165D,653  [FP-SOT109-1-IPC_B]
U11  74HC165D,653  [FP-SOT109-1-IPC_B]
U12  74HC165D,653  [FP-SOT109-1-IPC_B]
U13  74HC165D,653  [FP-SOT109-1-IPC_B]
U14  74HC165D,653  [FP-SOT109-1-IPC_B]
U15  74HC165D,653  [FP-SOT109-1-IPC_B]
U16  74HC165D,653  [FP-SOT109-1-IPC_B]
U17  74HC165D,653  [FP-SOT109-1-IPC_B]
Y1  W25Q128JVSIQ TR  [SOIC127P790X216-8N]
Y2  ABM8G-12.000MHZ-18-D2Y-T  [FP-ABM8G-MFG]

## Blocks framed on the sheet
ENCODER: C15 C18 ENC1 R1-R4
Flash memory: C2 Y1
OLED SCREEN: C19 P2
KEYBOARD LIGHTING: LED1-LED112
Keyboard: C25-C38 R7-R34 SW1-SW112 U4-U17

## Nets
+3V3 VCC: C2.1 C3.1 C7.1 C8.1 C9.1 C10.1 C11.1 C12.1 C13.1 C14.1 C17.1 C19.1 C20.1 C21.1 C25.1 C26.1 C27.1 C28.1 C29.1 C30.1 C31.1 C32.1 C33.1 C34.1 C35.1 C36.1 C37.1 C38.1 FP1.2 P2.2 R1.2 R4.1 R7.1 R7.2 R7.3 R7.4 R8.1 R8.2 R8.3 R8.4 R9.1 R9.2 R9.3 R9.4 R10.1 R10.2 R10.3 R10.4 R11.1 R11.2 R11.3 R11.4 R12.1 R12.2 R12.3 R12.4 R13.1 R13.2 R13.3 R13.4 R14.1 R14.2 R14.3 R14.4 R15.1 R15.2 R15.3 R15.4 R16.1 R16.2 R16.3 R16.4 R17.1 R17.2 R17.3 R17.4 R18.1 R18.2 R18.3 R18.4 R19.1 R19.2 R19.3 R19.4 R20.1 R20.2 R20.3 R20.4 R21.1 R21.2 R21.3 R21.4 R22.1 R22.2 R22.3 R22.4 R23.1 R23.2 R23.3 R23.4 R24.1 R24.2 R24.3 R24.4 R25.1 R25.2 R25.3 R25.4 R26.1 R26.2 R26.3 R26.4 R27.1 R27.2 R27.3 R27.4 R28.1 R28.2 R28.3 R28.4 R29.1 R29.2 R29.3 R29.4 R30.1 R30.2 R30.3 R30.4 R31.1 R31.2 R31.3 R31.4 R32.1 R32.2 R32.3 R32.4 R33.1 R33.2 R33.3 R33.4 R34.1 R34.2 R34.3 R34.4 U1.3(OUT) U2.1(VIN) U3.1(IOVDD) U3.10(IOVDD) U3.22(IOVDD) U3.33(IOVDD) U3.42(IOVDD) U3.43(ADC_AVDD) U3.44(VREG_VIN) U3.48(USB_VDD) U3.49(IOVDD) U4.16(VCC) U5.16(VCC) U6.16(VCC) U7.16(VCC) U8.16(VCC) U9.16(VCC) U10.16(VCC) U11.16(VCC) U12.16(VCC) U13.16(VCC) U14.16(VCC) U15.16(VCC) U16.16(VCC) U17.16(VCC) Y1.8(VCC)
+5V VCC: C1.1 LED1.1(VDD) LED2.1(VDD) LED3.1(VDD) LED4.1(VDD) LED5.1(VDD) LED6.1(VDD) LED7.1(VDD) LED8.1(VDD) LED9.1(VDD) LED10.1(VDD) LED11.1(VDD) LED12.1(VDD) LED13.1(VDD) LED14.1(VDD) LED15.1(VDD) LED16.1(VDD) LED17.1(VDD) LED18.1(VDD) LED19.1(VDD) LED20.1(VDD) LED21.1(VDD) LED22.1(VDD) LED23.1(VDD) LED24.1(VDD) LED25.1(VDD) LED26.1(VDD) LED27.1(VDD) LED28.1(VDD) LED29.1(VDD) LED30.1(VDD) LED31.1(VDD) LED32.1(VDD) LED33.1(VDD) LED34.1(VDD) LED35.1(VDD) LED36.1(VDD) LED37.1(VDD) LED38.1(VDD) LED39.1(VDD) LED40.1(VDD) LED41.1(VDD) LED42.1(VDD) LED43.1(VDD) LED44.1(VDD) LED45.1(VDD) LED46.1(VDD) LED47.1(VDD) LED48.1(VDD) LED49.1(VDD) LED50.1(VDD) LED51.1(VDD) LED52.1(VDD) LED53.1(VDD) LED54.1(VDD) LED55.1(VDD) LED56.1(VDD) LED57.1(VDD) LED58.1(VDD) LED59.1(VDD) LED60.1(VDD) LED61.1(VDD) LED62.1(VDD) LED63.1(VDD) LED64.1(VDD) LED65.1(VDD) LED66.1(VDD) LED67.1(VDD) LED68.1(VDD) LED69.1(VDD) LED70.1(VDD) LED71.1(VDD) LED72.1(VDD) LED73.1(VDD) LED74.1(VDD) LED75.1(VDD) LED76.1(VDD) LED77.1(VDD) LED78.1(VDD) LED79.1(VDD) LED80.1(VDD) LED81.1(VDD) LED82.1(VDD) LED83.1(VDD) LED84.1(VDD) LED85.1(VDD) LED86.1(VDD) LED87.1(VDD) LED88.1(VDD) LED89.1(VDD) LED90.1(VDD) LED91.1(VDD) LED92.1(VDD) LED93.1(VDD) LED94.1(VDD) LED95.1(VDD) LED96.1(VDD) LED97.1(VDD) LED98.1(VDD) LED99.1(VDD) LED100.1(VDD) LED101.1(VDD) LED102.1(VDD) LED103.1(VDD) LED104.1(VDD) LED105.1(VDD) LED106.1(VDD) LED107.1(VDD) LED108.1(VDD) LED109.1(VDD) LED110.1(VDD) LED111.1(VDD) LED112.1(VDD) P1.1 U1.1(INPUT)
GND: C1.2 C2.2 C3.2 C4.2 C5.2 C6.2 C7.2 C8.2 C9.2 C10.2 C11.2 C12.2 C13.2 C14.2 C15.1 C16.2 C17.2 C18.2 C19.2 C20.2 C21.2 C22.1 C23.2 C24.1 C25.2 C26.2 C27.2 C28.2 C29.2 C30.2 C31.2 C32.2 C33.2 C34.2 C35.2 C36.2 C37.2 C38.2 ENC1.2 ENC1.3(MNT_1) ENC1.4(MNT_2) ENC1.C(COMMON) FP1.8 FP1.9 FP1.10 LED1.3(VSS) LED2.3(VSS) LED3.3(VSS) LED4.3(VSS) LED5.3(VSS) LED6.3(VSS) LED7.3(VSS) LED8.3(VSS) LED9.3(VSS) LED10.3(VSS) LED11.3(VSS) LED12.3(VSS) LED13.3(VSS) LED14.3(VSS) LED15.3(VSS) LED16.3(VSS) LED17.3(VSS) LED18.3(VSS) LED19.3(VSS) LED20.3(VSS) LED21.3(VSS) LED22.3(VSS) LED23.3(VSS) LED24.3(VSS) LED25.3(VSS) LED26.3(VSS) LED27.3(VSS) LED28.3(VSS) LED29.3(VSS) LED30.3(VSS) LED31.3(VSS) LED32.3(VSS) LED33.3(VSS) LED34.3(VSS) LED35.3(VSS) LED36.3(VSS) LED37.3(VSS) LED38.3(VSS) LED39.3(VSS) LED40.3(VSS) LED41.3(VSS) LED42.3(VSS) LED43.3(VSS) LED44.3(VSS) LED45.3(VSS) LED46.3(VSS) LED47.3(VSS) LED48.3(VSS) LED49.3(VSS) LED50.3(VSS) LED51.3(VSS) LED52.3(VSS) LED53.3(VSS) LED54.3(VSS) LED55.3(VSS) LED56.3(VSS) LED57.3(VSS) LED58.3(VSS) LED59.3(VSS) LED60.3(VSS) LED61.3(VSS) LED62.3(VSS) LED63.3(VSS) LED64.3(VSS) LED65.3(VSS) LED66.3(VSS) LED67.3(VSS) LED68.3(VSS) LED69.3(VSS) LED70.3(VSS) LED71.3(VSS) LED72.3(VSS) LED73.3(VSS) LED74.3(VSS) LED75.3(VSS) LED76.3(VSS) LED77.3(VSS) LED78.3(VSS) LED79.3(VSS) LED80.3(VSS) LED81.3(VSS) LED82.3(VSS) LED83.3(VSS) LED84.3(VSS) LED85.3(VSS) LED86.3(VSS) LED87.3(VSS) LED88.3(VSS) LED89.3(VSS) LED90.3(VSS) LED91.3(VSS) LED92.3(VSS) LED93.3(VSS) LED94.3(VSS) LED95.3(VSS) LED96.3(VSS) LED97.3(VSS) LED98.3(VSS) LED99.3(VSS) LED100.3(VSS) LED101.3(VSS) LED102.3(VSS) LED103.3(VSS) LED104.3(VSS) LED105.3(VSS) LED106.3(VSS) LED107.3(VSS) LED108.3(VSS) LED109.3(VSS) LED110.3(VSS) LED111.3(VSS) LED112.3(VSS) P1.4 P2.1 SW1.2 SW2.2 SW3.2 SW4.2 SW5.2 SW6.2 SW7.2 SW8.2 SW9.2 SW10.2 SW11.2 SW12.2 SW13.2 SW14.2 SW15.2 SW16.2 SW17.2 SW18.2 SW19.2 SW20.2 SW21.2 SW22.2 SW23.2 SW24.2 SW25.2 SW26.2 SW27.2 SW28.2 SW29.2 SW30.2 SW31.2 SW32.2 SW33.2 SW34.2 SW35.2 SW36.2 SW37.2 SW38.2 SW39.2 SW40.2 SW41.2 SW42.2 SW43.2 SW44.2 SW45.2 SW46.2 SW47.2 SW48.2 SW49.2 SW50.2 SW51.2 SW52.2 SW53.2 SW54.2 SW55.2 SW56.2 SW57.2 SW58.2 SW59.2 SW60.2 SW61.2 SW62.2 SW63.2 SW64.2 SW65.2 SW66.2 SW67.2 SW68.2 SW69.2 SW70.2 SW71.2 SW72.2 SW73.2 SW74.2 SW75.2 SW76.2 SW77.2 SW78.2 SW79.2 SW80.2 SW81.2 SW82.2 SW83.2 SW84.2 SW85.2 SW86.2 SW87.2 SW88.2 SW89.2 SW90.2 SW91.2 SW92.2 SW93.2 SW94.2 SW95.2 SW96.2 SW97.2 SW98.2 SW99.2 SW100.2 SW101.2 SW102.2 SW103.2 SW104.2 SW105.2 SW106.2 SW107.2 SW108.2 SW109.2 SW110.2 SW111.2 SW112.2 U1.2(GND) U1.4(GND) U2.2(GND) U3.19(TESTEN) U3.57(GND) U4.8(GND) U5.8(GND) U6.8(GND) U7.8(GND) U8.8(GND) U9.8(GND) U10.8(GND) U11.8(GND) U12.8(GND) U13.8(GND) U14.8(GND) U15.8(GND) U16.8(GND) U17.8(GND) Y1.4(GND) Y2.2(GND) Y2.4(GND)
1V1: C4.1 C5.1 C6.1 C16.1 U3.23(DVDD) U3.45(VREG_VOUT) U3.50(DVDD)
CapsLED: LED69.4(DIN) U3.15(GPIO12)
CLKCTRL: U3.27(GPIO16) U4.2(CP) U5.2(CP) U6.2(CP) U7.2(CP) U8.2(CP) U9.2(CP) U10.2(CP) U11.2(CP) U12.2(CP) U13.2(CP) U14.2(CP) U15.2(CP) U16.2(CP) U17.2(CP)  [also labelled MATRIXCLK]
CLKINH: U3.28(GPIO17) U4.15(~{CE}) U5.15(~{CE}) U6.15(~{CE}) U7.15(~{CE}) U8.15(~{CE}) U9.15(~{CE}) U10.15(~{CE}) U11.15(~{CE}) U12.15(~{CE}) U13.15(~{CE}) U14.15(~{CE}) U15.15(~{CE}) U16.15(~{CE}) U17.15(~{CE})  [also labelled MATRIX CLKINH]
ENCCLK: C15.2 R2.1 U3.12(GPIO9)
ENCDT: C18.1 R3.1 U3.13(GPIO10)
ENCSW: ENC1.1 U3.11(GPIO8)
FP_CTRL: U2.3(CTRL) U3.37(GPIO25)
FP_TOUCH_OUT: FP1.1 U3.41(GPIO29)
FP_UART_RX: FP1.5 U3.40(GPIO28)
FP_UART_TX: FP1.4 U3.39(GPIO27)
FP_VDD: C23.1 FP1.3 U2.5(VOUT)
I2C0_SCL_Display: P2.3 U3.35(GPIO23)
I2C0_SDA_Display: P2.4 U3.34(GPIO22)
KBLIGHT_ROW1END: LED28.2(DOUT) LED29.4(DIN)
KBLIGHT_ROW2END: LED56.2(DOUT) LED57.4(DIN)
KBLIGHT_ROW3END: LED84.2(DOUT) LED85.4(DIN)
KBLIGHTING_IN: LED1.4(DIN) U3.14(GPIO11)
MATRIX QH: U3.30(GPIO19) U4.9(Q7)
MATRIX SH/LD: U3.29(GPIO18) U4.1(~{PL}) U5.1(~{PL}) U6.1(~{PL}) U7.1(~{PL}) U8.1(~{PL}) U9.1(~{PL}) U10.1(~{PL}) U11.1(~{PL}) U12.1(~{PL}) U13.1(~{PL}) U14.1(~{PL}) U15.1(~{PL}) U16.1(~{PL}) U17.1(~{PL})  [also labelled SH]
MCU_USB_D_N: R6.2 U3.46(USB_DM)
MCU_USB_D_P: R5.2 U3.47(USB_DP)
MCU_USB_D_R_N: P1.2 R6.1
MCU_USB_D_R_P: P1.3 R5.1
QSPI_SCLK: U3.52(QSPI_SCLK) Y1.6(CLK)
QSPI_SD0: U3.53(QSPI_SD0) Y1.5(DI_(IO0))
QSPI_SD1: U3.55(QSPI_SD1) Y1.2(DO_(IO1))
QSPI_SD2: U3.54(QSPI_SD2) Y1.3(/WP_(IO2))
QSPI_SD3: U3.51(QSPI_SD3) Y1.7(/RESET_(IO3))
QSPI_SS_N: U3.56(QSPI_SS_N) Y1.1(/CS)
SERNEXT: U13.10(DS) U14.9(Q7)
XIN RP2040: C24.2 U3.20(XIN) Y2.1
XOUT RP2040: C22.2 U3.21(XOUT) Y2.3
NetENC1_A: ENC1.A(CHANNEL_A) R1.1 R2.2
NetENC1_B: ENC1.B(CHANNEL_B) R3.2 R4.2
NetLED1_2: LED1.2(DOUT) LED2.4(DIN)
NetLED2_2: LED2.2(DOUT) LED3.4(DIN)
NetLED3_2: LED3.2(DOUT) LED4.4(DIN)
NetLED4_2: LED4.2(DOUT) LED5.4(DIN)
NetLED5_2: LED5.2(DOUT) LED6.4(DIN)
NetLED6_2: LED6.2(DOUT) LED7.4(DIN)
NetLED7_2: LED7.2(DOUT) LED8.4(DIN)
NetLED8_2: LED8.2(DOUT) LED9.4(DIN)
NetLED9_2: LED9.2(DOUT) LED10.4(DIN)
NetLED10_2: LED10.2(DOUT) LED11.4(DIN)
NetLED11_2: LED11.2(DOUT) LED12.4(DIN)
NetLED12_2: LED12.2(DOUT) LED13.4(DIN)
NetLED13_2: LED13.2(DOUT) LED14.4(DIN)
NetLED14_2: LED14.2(DOUT) LED15.4(DIN)
NetLED15_2: LED15.2(DOUT) LED16.4(DIN)
NetLED16_2: LED16.2(DOUT) LED17.4(DIN)
NetLED17_2: LED17.2(DOUT) LED18.4(DIN)
NetLED18_2: LED18.2(DOUT) LED19.4(DIN)
NetLED19_2: LED19.2(DOUT) LED20.4(DIN)
NetLED20_2: LED20.2(DOUT) LED21.4(DIN)
NetLED21_2: LED21.2(DOUT) LED22.4(DIN)
NetLED22_2: LED22.2(DOUT) LED23.4(DIN)
NetLED23_2: LED23.2(DOUT) LED24.4(DIN)
NetLED24_2: LED24.2(DOUT) LED25.4(DIN)
NetLED25_2: LED25.2(DOUT) LED26.4(DIN)
NetLED26_2: LED26.2(DOUT) LED27.4(DIN)
NetLED27_2: LED27.2(DOUT) LED28.4(DIN)
NetLED29_2: LED29.2(DOUT) LED30.4(DIN)
NetLED30_2: LED30.2(DOUT) LED31.4(DIN)
NetLED31_2: LED31.2(DOUT) LED32.4(DIN)
NetLED32_2: LED32.2(DOUT) LED33.4(DIN)
NetLED33_2: LED33.2(DOUT) LED34.4(DIN)
NetLED34_2: LED34.2(DOUT) LED35.4(DIN)
NetLED35_2: LED35.2(DOUT) LED36.4(DIN)
NetLED36_2: LED36.2(DOUT) LED37.4(DIN)
NetLED37_2: LED37.2(DOUT) LED38.4(DIN)
NetLED38_2: LED38.2(DOUT) LED39.4(DIN)
NetLED39_2: LED39.2(DOUT) LED40.4(DIN)
NetLED40_2: LED40.2(DOUT) LED41.4(DIN)
NetLED41_2: LED41.2(DOUT) LED42.4(DIN)
NetLED42_2: LED42.2(DOUT) LED43.4(DIN)
NetLED43_2: LED43.2(DOUT) LED44.4(DIN)
NetLED44_2: LED44.2(DOUT) LED45.4(DIN)
NetLED45_2: LED45.2(DOUT) LED46.4(DIN)
NetLED46_2: LED46.2(DOUT) LED47.4(DIN)
NetLED47_2: LED47.2(DOUT) LED48.4(DIN)
NetLED48_2: LED48.2(DOUT) LED49.4(DIN)
NetLED49_2: LED49.2(DOUT) LED50.4(DIN)
NetLED50_2: LED50.2(DOUT) LED51.4(DIN)
NetLED51_2: LED51.2(DOUT) LED52.4(DIN)
NetLED52_2: LED52.2(DOUT) LED53.4(DIN)
NetLED53_2: LED53.2(DOUT) LED54.4(DIN)
NetLED54_2: LED54.2(DOUT) LED55.4(DIN)
NetLED55_2: LED55.2(DOUT) LED56.4(DIN)
NetLED57_2: LED57.2(DOUT) LED58.4(DIN)
NetLED58_2: LED58.2(DOUT) LED59.4(DIN)
NetLED59_2: LED59.2(DOUT) LED60.4(DIN)
NetLED60_2: LED60.2(DOUT) LED61.4(DIN)
NetLED61_2: LED61.2(DOUT) LED62.4(DIN)
NetLED62_2: LED62.2(DOUT) LED63.4(DIN)
NetLED63_2: LED63.2(DOUT) LED64.4(DIN)
NetLED64_2: LED64.2(DOUT) LED65.4(DIN)
NetLED65_2: LED65.2(DOUT) LED66.4(DIN)
NetLED66_2: LED66.2(DOUT) LED67.4(DIN)
NetLED67_2: LED67.2(DOUT) LED68.4(DIN)
NetLED68_2: LED68.2(DOUT) LED70.4(DIN)
NetLED70_2: LED70.2(DOUT) LED71.4(DIN)
NetLED71_2: LED71.2(DOUT) LED72.4(DIN)
NetLED72_2: LED72.2(DOUT) LED73.4(DIN)
NetLED73_2: LED73.2(DOUT) LED74.4(DIN)
NetLED74_2: LED74.2(DOUT) LED75.4(DIN)
NetLED75_2: LED75.2(DOUT) LED76.4(DIN)
NetLED76_2: LED76.2(DOUT) LED77.4(DIN)
NetLED77_2: LED77.2(DOUT) LED78.4(DIN)
NetLED78_2: LED78.2(DOUT) LED79.4(DIN)
NetLED79_2: LED79.2(DOUT) LED80.4(DIN)
NetLED80_2: LED80.2(DOUT) LED81.4(DIN)
NetLED81_2: LED81.2(DOUT) LED82.4(DIN)
NetLED82_2: LED82.2(DOUT) LED83.4(DIN)
NetLED83_2: LED83.2(DOUT) LED84.4(DIN)
NetLED85_2: LED85.2(DOUT) LED86.4(DIN)
NetLED86_2: LED86.2(DOUT) LED87.4(DIN)
NetLED87_2: LED87.2(DOUT) LED88.4(DIN)
NetLED88_2: LED88.2(DOUT) LED89.4(DIN)
NetLED89_2: LED89.2(DOUT) LED90.4(DIN)
NetLED90_2: LED90.2(DOUT) LED91.4(DIN)
NetLED91_2: LED91.2(DOUT) LED92.4(DIN)
NetLED92_2: LED92.2(DOUT) LED93.4(DIN)
NetLED93_2: LED93.2(DOUT) LED94.4(DIN)
NetLED94_2: LED94.2(DOUT) LED95.4(DIN)
NetLED95_2: LED95.2(DOUT) LED96.4(DIN)
NetLED96_2: LED96.2(DOUT) LED97.4(DIN)
NetLED97_2: LED97.2(DOUT) LED98.4(DIN)
NetLED98_2: LED98.2(DOUT) LED99.4(DIN)
NetLED99_2: LED99.2(DOUT) LED100.4(DIN)
NetLED100_2: LED100.2(DOUT) LED101.4(DIN)
NetLED101_2: LED101.2(DOUT) LED102.4(DIN)
NetLED102_2: LED102.2(DOUT) LED103.4(DIN)
NetLED103_2: LED103.2(DOUT) LED104.4(DIN)
NetLED104_2: LED104.2(DOUT) LED105.4(DIN)
NetLED105_2: LED105.2(DOUT) LED106.4(DIN)
NetLED106_2: LED106.2(DOUT) LED107.4(DIN)
NetLED107_2: LED107.2(DOUT) LED108.4(DIN)
NetLED108_2: LED108.2(DOUT) LED109.4(DIN)
NetLED109_2: LED109.2(DOUT) LED110.4(DIN)
NetLED110_2: LED110.2(DOUT) LED111.4(DIN)
NetLED111_2: LED111.2(DOUT) LED112.4(DIN)
NetR7_5: R7.5 SW4.1 U4.3(D4)
NetR7_6: R7.6 SW3.1 U4.4(D5)
NetR7_7: R7.7 SW2.1 U4.5(D6)
NetR7_8: R7.8 SW1.1 U4.6(D7)
NetR8_5: R8.5 SW12.1 U5.3(D4)
NetR8_6: R8.6 SW11.1 U5.4(D5)
NetR8_7: R8.7 SW10.1 U5.5(D6)
NetR8_8: R8.8 SW9.1 U5.6(D7)
NetR9_5: R9.5 SW20.1 U6.3(D4)
NetR9_6: R9.6 SW19.1 U6.4(D5)
NetR9_7: R9.7 SW18.1 U6.5(D6)
NetR9_8: R9.8 SW17.1 U6.6(D7)
NetR10_5: R10.5 SW28.1 U7.3(D4)
NetR10_6: R10.6 SW27.1 U7.4(D5)
NetR10_7: R10.7 SW26.1 U7.5(D6)
NetR10_8: R10.8 SW25.1 U7.6(D7)
NetR11_5: R11.5 SW36.1 U8.3(D4)
NetR11_6: R11.6 SW35.1 U8.4(D5)
NetR11_7: R11.7 SW34.1 U8.5(D6)
NetR11_8: R11.8 SW33.1 U8.6(D7)
NetR12_5: R12.5 SW44.1 U9.3(D4)
NetR12_6: R12.6 SW43.1 U9.4(D5)
NetR12_7: R12.7 SW42.1 U9.5(D6)
NetR12_8: R12.8 SW41.1 U9.6(D7)
NetR13_5: R13.5 SW52.1 U10.3(D4)
NetR13_6: R13.6 SW51.1 U10.4(D5)
NetR13_7: R13.7 SW50.1 U10.5(D6)
NetR13_8: R13.8 SW49.1 U10.6(D7)
NetR14_5: R14.5 SW60.1 U11.3(D4)
NetR14_6: R14.6 SW59.1 U11.4(D5)
NetR14_7: R14.7 SW58.1 U11.5(D6)
NetR14_8: R14.8 SW57.1 U11.6(D7)
NetR15_5: R15.5 SW68.1 U12.3(D4)
NetR15_6: R15.6 SW67.1 U12.4(D5)
NetR15_7: R15.7 SW66.1 U12.5(D6)
NetR15_8: R15.8 SW65.1 U12.6(D7)
NetR16_5: R16.5 SW76.1 U13.3(D4)
NetR16_6: R16.6 SW75.1 U13.4(D5)
NetR16_7: R16.7 SW74.1 U13.5(D6)
NetR16_8: R16.8 SW73.1 U13.6(D7)
NetR17_5: R17.5 SW8.1 U4.11(D0)
NetR17_6: R17.6 SW7.1 U4.12(D1)
NetR17_7: R17.7 SW6.1 U4.13(D2)
NetR17_8: R17.8 SW5.1 U4.14(D3)
NetR18_5: R18.5 SW16.1 U5.11(D0)
NetR18_6: R18.6 SW15.1 U5.12(D1)
NetR18_7: R18.7 SW14.1 U5.13(D2)
NetR18_8: R18.8 SW13.1 U5.14(D3)
NetR19_5: R19.5 SW24.1 U6.11(D0)
NetR19_6: R19.6 SW23.1 U6.12(D1)
NetR19_7: R19.7 SW22.1 U6.13(D2)
NetR19_8: R19.8 SW21.1 U6.14(D3)
NetR20_5: R20.5 SW32.1 U7.11(D0)
NetR20_6: R20.6 SW31.1 U7.12(D1)
NetR20_7: R20.7 SW30.1 U7.13(D2)
NetR20_8: R20.8 SW29.1 U7.14(D3)
NetR21_5: R21.5 SW40.1 U8.11(D0)
NetR21_6: R21.6 SW39.1 U8.12(D1)
NetR21_7: R21.7 SW38.1 U8.13(D2)
NetR21_8: R21.8 SW37.1 U8.14(D3)
NetR22_5: R22.5 SW48.1 U9.11(D0)
NetR22_6: R22.6 SW47.1 U9.12(D1)
NetR22_7: R22.7 SW46.1 U9.13(D2)
NetR22_8: R22.8 SW45.1 U9.14(D3)
NetR23_5: R23.5 SW56.1 U10.11(D0)
NetR23_6: R23.6 SW55.1 U10.12(D1)
NetR23_7: R23.7 SW54.1 U10.13(D2)
NetR23_8: R23.8 SW53.1 U10.14(D3)
NetR24_5: R24.5 SW64.1 U11.11(D0)
NetR24_6: R24.6 SW63.1 U11.12(D1)
NetR24_7: R24.7 SW62.1 U11.13(D2)
NetR24_8: R24.8 SW61.1 U11.14(D3)
NetR25_5: R25.5 SW72.1 U12.11(D0)
NetR25_6: R25.6 SW71.1 U12.12(D1)
NetR25_7: R25.7 SW70.1 U12.13(D2)
NetR25_8: R25.8 SW69.1 U12.14(D3)
NetR26_5: R26.5 SW80.1 U13.11(D0)
NetR26_6: R26.6 SW79.1 U13.12(D1)
NetR26_7: R26.7 SW78.1 U13.13(D2)
NetR26_8: R26.8 SW77.1 U13.14(D3)
NetR27_5: R27.5 SW84.1 U14.3(D4)
NetR27_6: R27.6 SW83.1 U14.4(D5)
NetR27_7: R27.7 SW82.1 U14.5(D6)
NetR27_8: R27.8 SW81.1 U14.6(D7)
NetR28_5: R28.5 SW92.1 U15.3(D4)
NetR28_6: R28.6 SW91.1 U15.4(D5)
NetR28_7: R28.7 SW90.1 U15.5(D6)
NetR28_8: R28.8 SW89.1 U15.6(D7)
NetR29_5: R29.5 SW100.1 U16.3(D4)
NetR29_6: R29.6 SW99.1 U16.4(D5)
NetR29_7: R29.7 SW98.1 U16.5(D6)
NetR29_8: R29.8 SW97.1 U16.6(D7)
NetR30_5: R30.5 SW108.1 U17.3(D4)
NetR30_6: R30.6 SW107.1 U17.4(D5)
NetR30_7: R30.7 SW106.1 U17.5(D6)
NetR30_8: R30.8 SW105.1 U17.6(D7)
NetR31_5: R31.5 SW88.1 U14.11(D0)
NetR31_6: R31.6 SW87.1 U14.12(D1)
NetR31_7: R31.7 SW86.1 U14.13(D2)
NetR31_8: R31.8 SW85.1 U14.14(D3)
NetR32_5: R32.5 SW96.1 U15.11(D0)
NetR32_6: R32.6 SW95.1 U15.12(D1)
NetR32_7: R32.7 SW94.1 U15.13(D2)
NetR32_8: R32.8 SW93.1 U15.14(D3)
NetR33_5: R33.5 SW104.1 U16.11(D0)
NetR33_6: R33.6 SW103.1 U16.12(D1)
NetR33_7: R33.7 SW102.1 U16.13(D2)
NetR33_8: R33.8 SW101.1 U16.14(D3)
NetR34_5: R34.5 SW112.1 U17.11(D0)
NetR34_6: R34.6 SW111.1 U17.12(D1)
NetR34_7: R34.7 SW110.1 U17.13(D2)
NetR34_8: R34.8 SW109.1 U17.14(D3)
NetU4_10: U4.10(DS) U5.9(Q7)
NetU5_10: U5.10(DS) U6.9(Q7)
NetU6_10: U6.10(DS) U7.9(Q7)
NetU7_10: U7.10(DS) U8.9(Q7)
NetU8_10: U8.10(DS) U9.9(Q7)
NetU9_10: U9.10(DS) U10.9(Q7)
NetU10_10: U10.10(DS) U11.9(Q7)
NetU11_10: U11.10(DS) U12.9(Q7)
NetU12_10: U12.10(DS) U13.9(Q7)
NetU14_10: U14.10(DS) U15.9(Q7)
NetU15_10: U15.10(DS) U16.9(Q7)
NetU16_10: U16.10(DS) U17.9(Q7)

Not connected (* = marked no-connect by the designer): FP1 6* 7* 11(MNT_1)* 12(MNT_2)*; LED69 2(DOUT); LED112 2(DOUT); U2 4(NC)*; U3 2(GPIO0) 3(GPIO1) 4(GPIO2) 5(GPIO3) 6(GPIO4) 7(GPIO5) 8(GPIO6) 9(GPIO7) 16(GPIO13) 17(GPIO14) 18(GPIO15) 24(SWCLK)* 25(SWDIO)* 26(RUN)* 31(GPIO20) 32(GPIO21) 36(GPIO24) 38(GPIO26); U4 7(~{Q7})*; U5 7(~{Q7})*; U6 7(~{Q7})*; U7 7(~{Q7})*; U8 7(~{Q7})*; U9 7(~{Q7})*; U10 7(~{Q7})*; U11 7(~{Q7})*; U12 7(~{Q7})*; U13 7(~{Q7})*; U14 7(~{Q7})*; U15 7(~{Q7})*; U16 7(~{Q7})*; U17 7(~{Q7})* 10(DS)*

## Layout directives
differential pair: MCU_USB_D_N, MCU_USB_D_P, MCU_USB_D_R_N, MCU_USB_D_R_P

## Notes on the sheet
- Fingerprint Sensor

## Library data of the parts
C1 = CMP-001-00077-3: Chip Capacitor, 470nF +/-20%, 25V, 0603, Thickness 1 mm; Tolerance: 10%; Max Operating Temperature: 85°C; Voltage Rating: 25V; Pins: 2; Case/Package: 0603; Mounting Technology: SMT; Min Operating Temperature: -55°C
C2 C4-C14 C19-C21 C23 C25-C38 = CMP-2100-03641-2: CAP CER 0.1UF 16V X7R 0402 / GRM155R71C104KA88D; Manufacturer: Murata; Standoff Height: 0mm; Tolerance: 10%; Voltage Rating: 16Vdc; Material: Ceramic; Capacitance: 0.10μF; Value: 0.10μF; RoHS: TRUE; Manufacturer Part Number: GRM155R71C104KA88D; Temperature Characteristic: X7R; Octopart: https://octopart.com/grm155r71c104ka88d-murata-196880; Digikey Description: CAP CER 0.1UF 16V X7R 0402; Device Class L3: Ceramic Capacitors; Height: 0.55mm; ComponentLink2Description: Datasheet; Temperature Range Low: -55°C; Ipc Land Pattern Name: CAPC10050X219; ComponentLink2URL: https://search.murata.co.jp/Ceramy/image/img/A01X/G101/ENG/GRM155R71H471KA01-01A.pdf; Device Class L1: Passive Components; Lead Free: yes; Category: Cap; Package: GRM15; Temperature: -55°C to +125°C; Device Class L2: Capacitors; Temperature Range High: +125°C; Mouser Description: 0402 0.1 uF 16V ±10 % Tolerance X7R SMT Multilayer Ceramic Capacitor
C3 = CMP-08246-003796-1: Multilayer Ceramic Capacitors 33μF ±20% 6.3V X5R SMD 0805 / C2012X5R0J336M125AC; Series: C; Capacitance: 33uF; Min Operating Temperature: -55°C; Depth: 1.25mm; Radiation Hardening: No; Package Quantity: 1; Height: 1.25mm; Max Operating Temperature: 85°C; REACH SVHC: No SVHC; Mount: Surface Mount; Construction: Flat; Case/Package: 0805; Dielectric Material: Ceramic; Thickness: 0.057inch; Case Code (Imperial): 0805; Lead Free: Lead Free; Weight: 0.000194oz; Case Code (Metric): 2012; Tolerance: 20%; Dielectric: X5R; RoHS Compliant: Yes; Length: 2mm; Packaging: Tape and Reel; Voltage Rating (DC): 6.3V; Width: 1.2mm; Resistor Type: Ceramic; Termination: SMD/SMT; Voltage Rating: 6.3V
C15 C18 = CMP-1033-00635-3: Chip Multilayer Ceramic Capacitors for General Purpose, 0201, 10000pF, X7R, 15%, 10%, 6.3V / GRM033R70J103KA01D; Capacitance: 10nF; Lead Free: Lead Free; Max Operating Temperature: 125°C; Height: 0.3mm; REACH SVHC: No SVHC; Voltage Rating: 6.3V; Width: 0.012inch; Tolerance: 10%; Min Operating Temperature: -55°C; Length: 0.6mm; Voltage Rating (DC): 6.3V; Thickness: 0.013inch; Depth: 0.3mm; Case/Package: 0201; Case Code (Imperial): 0201; Packaging: Tape and Reel; Voltage: 6.3V; Package Quantity: 15000; Mount: Surface Mount; Case Code (Metric): 0603; Dielectric: X7R; Radiation Hardening: No; Termination: SMD/SMT
C16 C17 = CMP-06035-026070-1: Chip Multilayer Ceramic Capacitors for General Purpose, 0402, 10uF, X5R, 15%, 20%, 10V / GRM155R61A106ME11D
C22 C24 = CMP-2000-06334-1: Chip Capacitor, 18 pF, +/- 5%, 50 V, -55 to 125 degC, 0603 (1608 Metric), RoHS, Tape and Reel / GRM1885C1H180JA01D; Manufacturer: Murata; Voltage - Rated: 50V; Online Catalog: GRMSeries; Temperature Coefficient: C0G,NP0; Other Names: 490-1409-2GRM39C0G180J050AD; Capacitance: 18pF; Package / Case: 0603(1608Metric); Package Reference: 0603; Height - Seated (Max): -; Package Description: 2-Pin Surface Mount Device, Body 1.6 x 0.8 mm; Category: Capacitors; Applications: GeneralPurpose; Size / Dimension: 0.063"Lx0.031"W(1.60mmx0.80mm); Mounting Type: SurfaceMount,MLCC; Family: CeramicCapacitors; Packaging: Tape&Reel(TR); Tolerance: ±5%; Ratings: -; Operating Temperature: -55°C~125°C; Datasheet URL: http://search.murata.co.jp/Ceramy/image/img/A01X/G101/ENG/GRM1885C1H180JA01-01.pdf; Standard Package: 4,000; Lead Style: -; Thickness (Max): 0.035"(0.90mm); Manufacturer URL: http://www.murata.com/; Mounting Technology: SurfaceMount; Lead Spacing: -; Series: GRM; Features: -; Datasheet Version: 03/2016
ENC1 = CMP-07421-000032-1: ROTARY ENCODER MECHANICAL 24PPR; Output Type: Quadrature; Detent: No; Hole Diameter: 1.8mm; Number of Channels: 2; Pulses per Revolution: 24; Built in Switch: Yes; Mount: Through Hole; Max Operating Temperature: 70°C; Min Operating Temperature: -30°C; Length: 21.5mm; Width: 12.5mm; REACH SVHC: No SVHC; Orientation: Vertical; Packaging: Bulk; Encoder Type: Mechanical; Number of Pins: 5; Package Quantity: 75; Series: PEC11R; Radiation Hardening: No; RoHS Compliant: Yes; Termination: PC Pin; Height: 13.4mm
FP1 = CMP-04775-000007-1: CONN FPC BOTTOM 10POS .5MM R/A; Pitch: 0.02inch; Actuator Material: Nylon; Voltage Rating: 50V; Gender: Receptacle; Current Rating: 500mA; Number of Positions: 10; Termination: Solder; Contact Plating: Gold; RoHS Compliant: Yes; Number of Rows: 1; Flammability Rating: UL94 V-0; Packaging: Tape and Reel; Housing Material: Polymer; Contact Material: Bronze; Min Operating Temperature: -40°C; Mount: Surface Mount; Max Operating Temperature: 105°C
LED1-LED112 = CMP-007-00037-20: WS2812B 5050 RGB LED WITH INTEGRATED DRIVER CHIP PACK OF 10
P1 = CMP-2000-05165-1: Male Header, Pitch 2 mm, 1 x 4 Position, Height 6 mm, Tail Length 3.4 mm, -25 to 85 degC, RoHS, Bulk; Manufacturer: JST; No of Positions: 4; Style/Orientation: StraightHeader/Plug; Pitch: 2mm; Datasheet URL: http://datasheet.octopart.com/B4B-PH-K-S%28LF%29%28SN%29-JST-datasheet-10558886.pdf; Type: ShroudedHeader; Manufacturer URL: http://www.jst.com/home2.html; Termination: Crimp; Datasheet Version: Apr-09
P2 = CMP-1502-01064-1: THT Vertical Pin Header WR-PHD, Pitch 2.54 mm, Single Row, 4 pins; Manufacturer: Wurth Elektronik; Withstanding Voltage: 500VAC; Rated Current: 3A; Working Voltage: 250VAC; Pin Number: 4; Gender: Male; Contact Resistance: 20mOhm; Pitch: 2.54mm; Manufacturer URL: http://www.we-online.de; Operating Temperature: -40to105degC; Packaging: Bag; Mounting Technology: THT; Package Reference: 61300411121; Datasheet URL: https://katalog.we-online.de/em/datasheet/6130xx11121.pdf; Publisher: WurthElektronik; Part Number: 61300411121; Row Number: Single; Orientation: Vertical
R1-R4 = CMP-2002-00433-1: ERJ-2GEJ103X / 10kohm resistor; Manufacturer: Panasonic; Part Number: ERJ-2GEJ103X
R5 R6 = CMP-009-00177-1: Fixed Resistor, Metal Glaze/thick Film, 0.0625W, 27ohm, 50V, 1% +/-Tol, 100ppm/Cel, Surface Mount, 0402; Power: 62.5mW; Additional Feature: LASER TRIMMABLE; Construction: Chip; RoHS Compliant: Yes; Mounting Technology: Surface Mount; Case/Package: 0402; Max Operating Temperature: 155°C; Tolerance: 1%; Min Operating Temperature: -55°C; JESD-609 Code: e3; Pins: 2
R7-R34 = CMP-1747-00005-1: Chip Resistor Array, 10 KOhm, +/- 5%, 62.5 mW, -55 to 125 degC, 8-Pin SMD, RoHS, Tape and Reel; Power Rating: 100 mW; Case\Package: 0603; Voltage Rating: 75 V; Tolerance: 1%; Resistance: 220 Ohm; Packaging: Tape and Reel; Min Operating Temperature: -55 degC; Pins: 2; Radiation Hardening: No; DatasheetVersion: Jan-15; Length: 0.063 inch; RoHSCompliant: true; Mount: Surface Mount; ComponentLink1Description: Manufacturer URL; ComponentLink1URL: http://www.bourns.com/; Weight: 7.1E-05 oz; ComponentLink2URL: http://www.bourns.com/docs/Product-Datasheets/CATCAY.pdf; PackageReference: CAY16-J4; Width: 0.031 inch; Case Code (Imperial): 0603; Case Code (Metric): 1608; REACH SVHC: Yes; Max Operating Temperature: 155 degC; ComponentLink2Description: Datasheet; Height: 0.022 inch; PackageDescription: 8-Pin Surface Mount Device, Body 1.6 x 3.2 mm, Pitch 0.8 mm
SW1-SW112 = CMP-011-00013-15: Keypad Switch, 1 Switches, SPST, Momentary, 0.01A, 12VDC, 0.78N, Solder Terminal, Through Hole-straight Hole added for LED.; Circuit Configuration: 1X1; Body Height: 11.6mm; Body Breadth: 15.6inch; Body Length or Diameter: 15.6mm; RoHS Compliant: Yes; Mounting Technology: Through Hole; Max Operating Temperature: 70°C; Min Operating Temperature: -10°C
U1 = CMP-0062-01788-4: IC REG LINEAR 3.3V 1A SOT223-4; Min Input Voltage: 4.5V; Max Supply Voltage: 7.5V; Number of Outputs: 1; Output Type: Fixed; Polarity: Positive; Dropout Voltage: 500mV; Quiescent Current: 15mA; Max Output Voltage: 3.3V; Length: 6.5mm; Termination: SMD/SMT; Width: 3.56mm; Min Supply Voltage: 4.5V; Max Output Current: 1A; Case/Package: SOT-223; Output Voltage: 3.3V; Current Rating: 1A; Packaging: Tape and Reel; Lead Free: Lead Free; Nominal Output Voltage: 3.3V; Height: 1.6mm; Series: -; Output Configuration: Positive; Radiation Hardening: No; Number of Regulators: 1; Package Quantity: 1000; REACH SVHC: No SVHC; Max Input Voltage: 7.5V; Max Operating Temperature: 125°C; Min Operating Temperature: -40°C; Output Current: 1A; Contact Plating: Tin; Number of Pins: 4; Mount: Surface Mount
U2 = CMP-019-00050-1: Fixed Positive LDO Regulator, 3.3V, 0.2V Dropout, CMOS, PDSO5
U3 = CMP-020-00023-1: Mcu, 32 Bit, 133MHZ, QFN-56;
U4-U17 = CMP-016-00010-2: Parallel In Serial Out, HC/UH Series, 8-Bit, Right Direction, Complementary Output, CMOS, PDSO16; Nominal Supply Voltage: 5V; Max Supply Voltage: 6V; Min Supply Voltage: 2V; Clock Edge Trigger Type: Positive Edge; Count Direction: RIGHT; RoHS Compliant: Yes; Min Operating Temperature: -40°C; JESD-30 Code: R-PDSO-G16; Height - Seated (Max): 1.75mm; Logic Type: PARALLEL IN SERIAL OUT; Pins: 16; Max Operating Temperature: 125°C; Case/Package: SOP
Y1 = CMP-019-00049-1: Flash, 16MX8, PDSO8; Max Supply Voltage: 3.6V; Density: 134217728b; Clock Frequency: 133MHz; Memory Size: 16777216; Min Supply Voltage: 2.7V; RoHS Compliant: Yes; Height - Seated (Max): 2.16mm; JESD-30 Code: S-PDSO-G8; Pins: 8; Length: 5.23mm; Max Operating Temperature: 85°C; Min Operating Temperature: -40°C; Case/Package: SOP; Memory Format: FLASH
Y2 = CMP-2000-05039-3: Crystal 12MHz ±20ppm (Tol) ±30ppm (Stability) 18pF FUND 120Ω 4-Pin SMD T/R; Series Resistance: 120R; Max Operating Temperature: 85°C; Mount: Surface Mount; Width: 2.5mm; Series: ABM8G; Termination: SMD/SMT; Frequency Tolerance: 20ppm; Tolerance: 20ppm; Min Operating Temperature: -40°C; Operating Frequency: 12 MHz; Depth: 2.5mm; Load Capacitance: 18pF; Number of Pins: 4; Length: 3.2mm; Radiation Hardening: No; Frequency Stability: 30ppm; Height: 1mm; Packaging: Tape and Reel; Package Quantity: 1000; ESR (Equivalent Series Resistance): 120R; Lead Free: Lead Free; Frequency: 12MHz; Case/Package: CSMD